# EAGLE schematic piezo-driver_v0.9a-R001 (EAGLE 6.5.0)

## Sheet 1 of 3
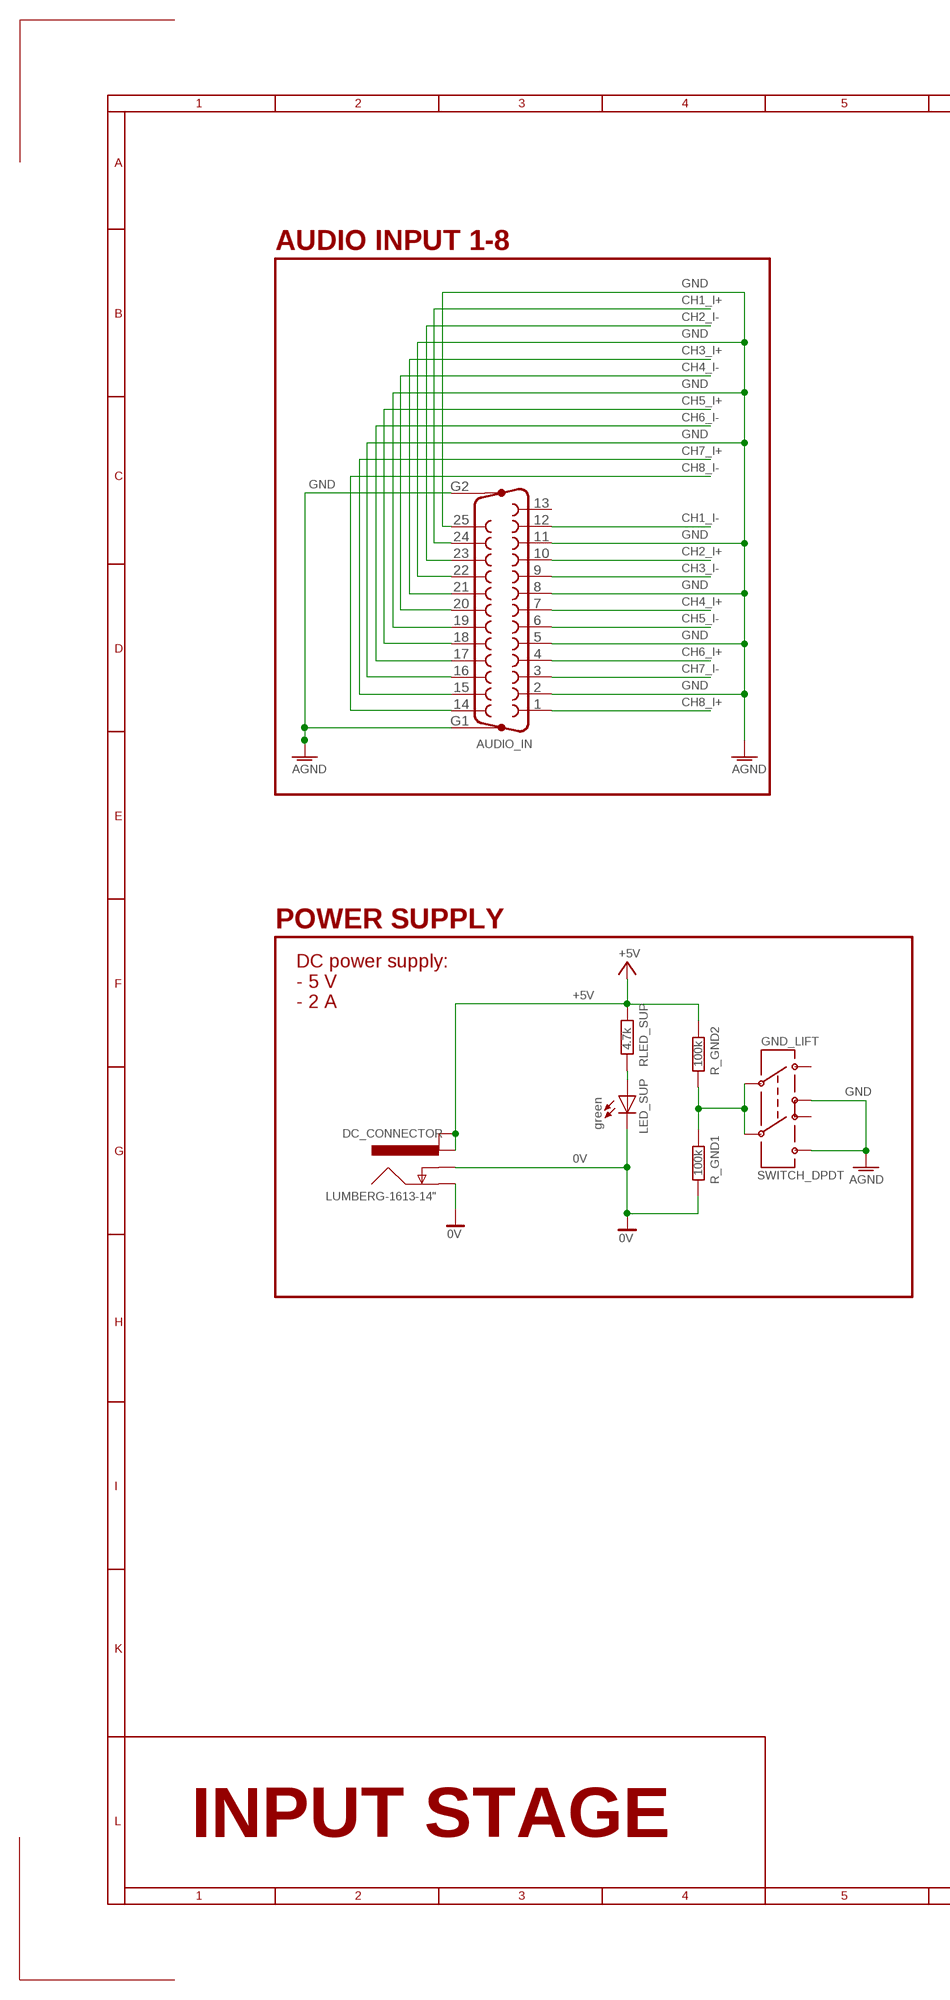
[diagram p0: schematic, sheet 1, part 1 of 2]
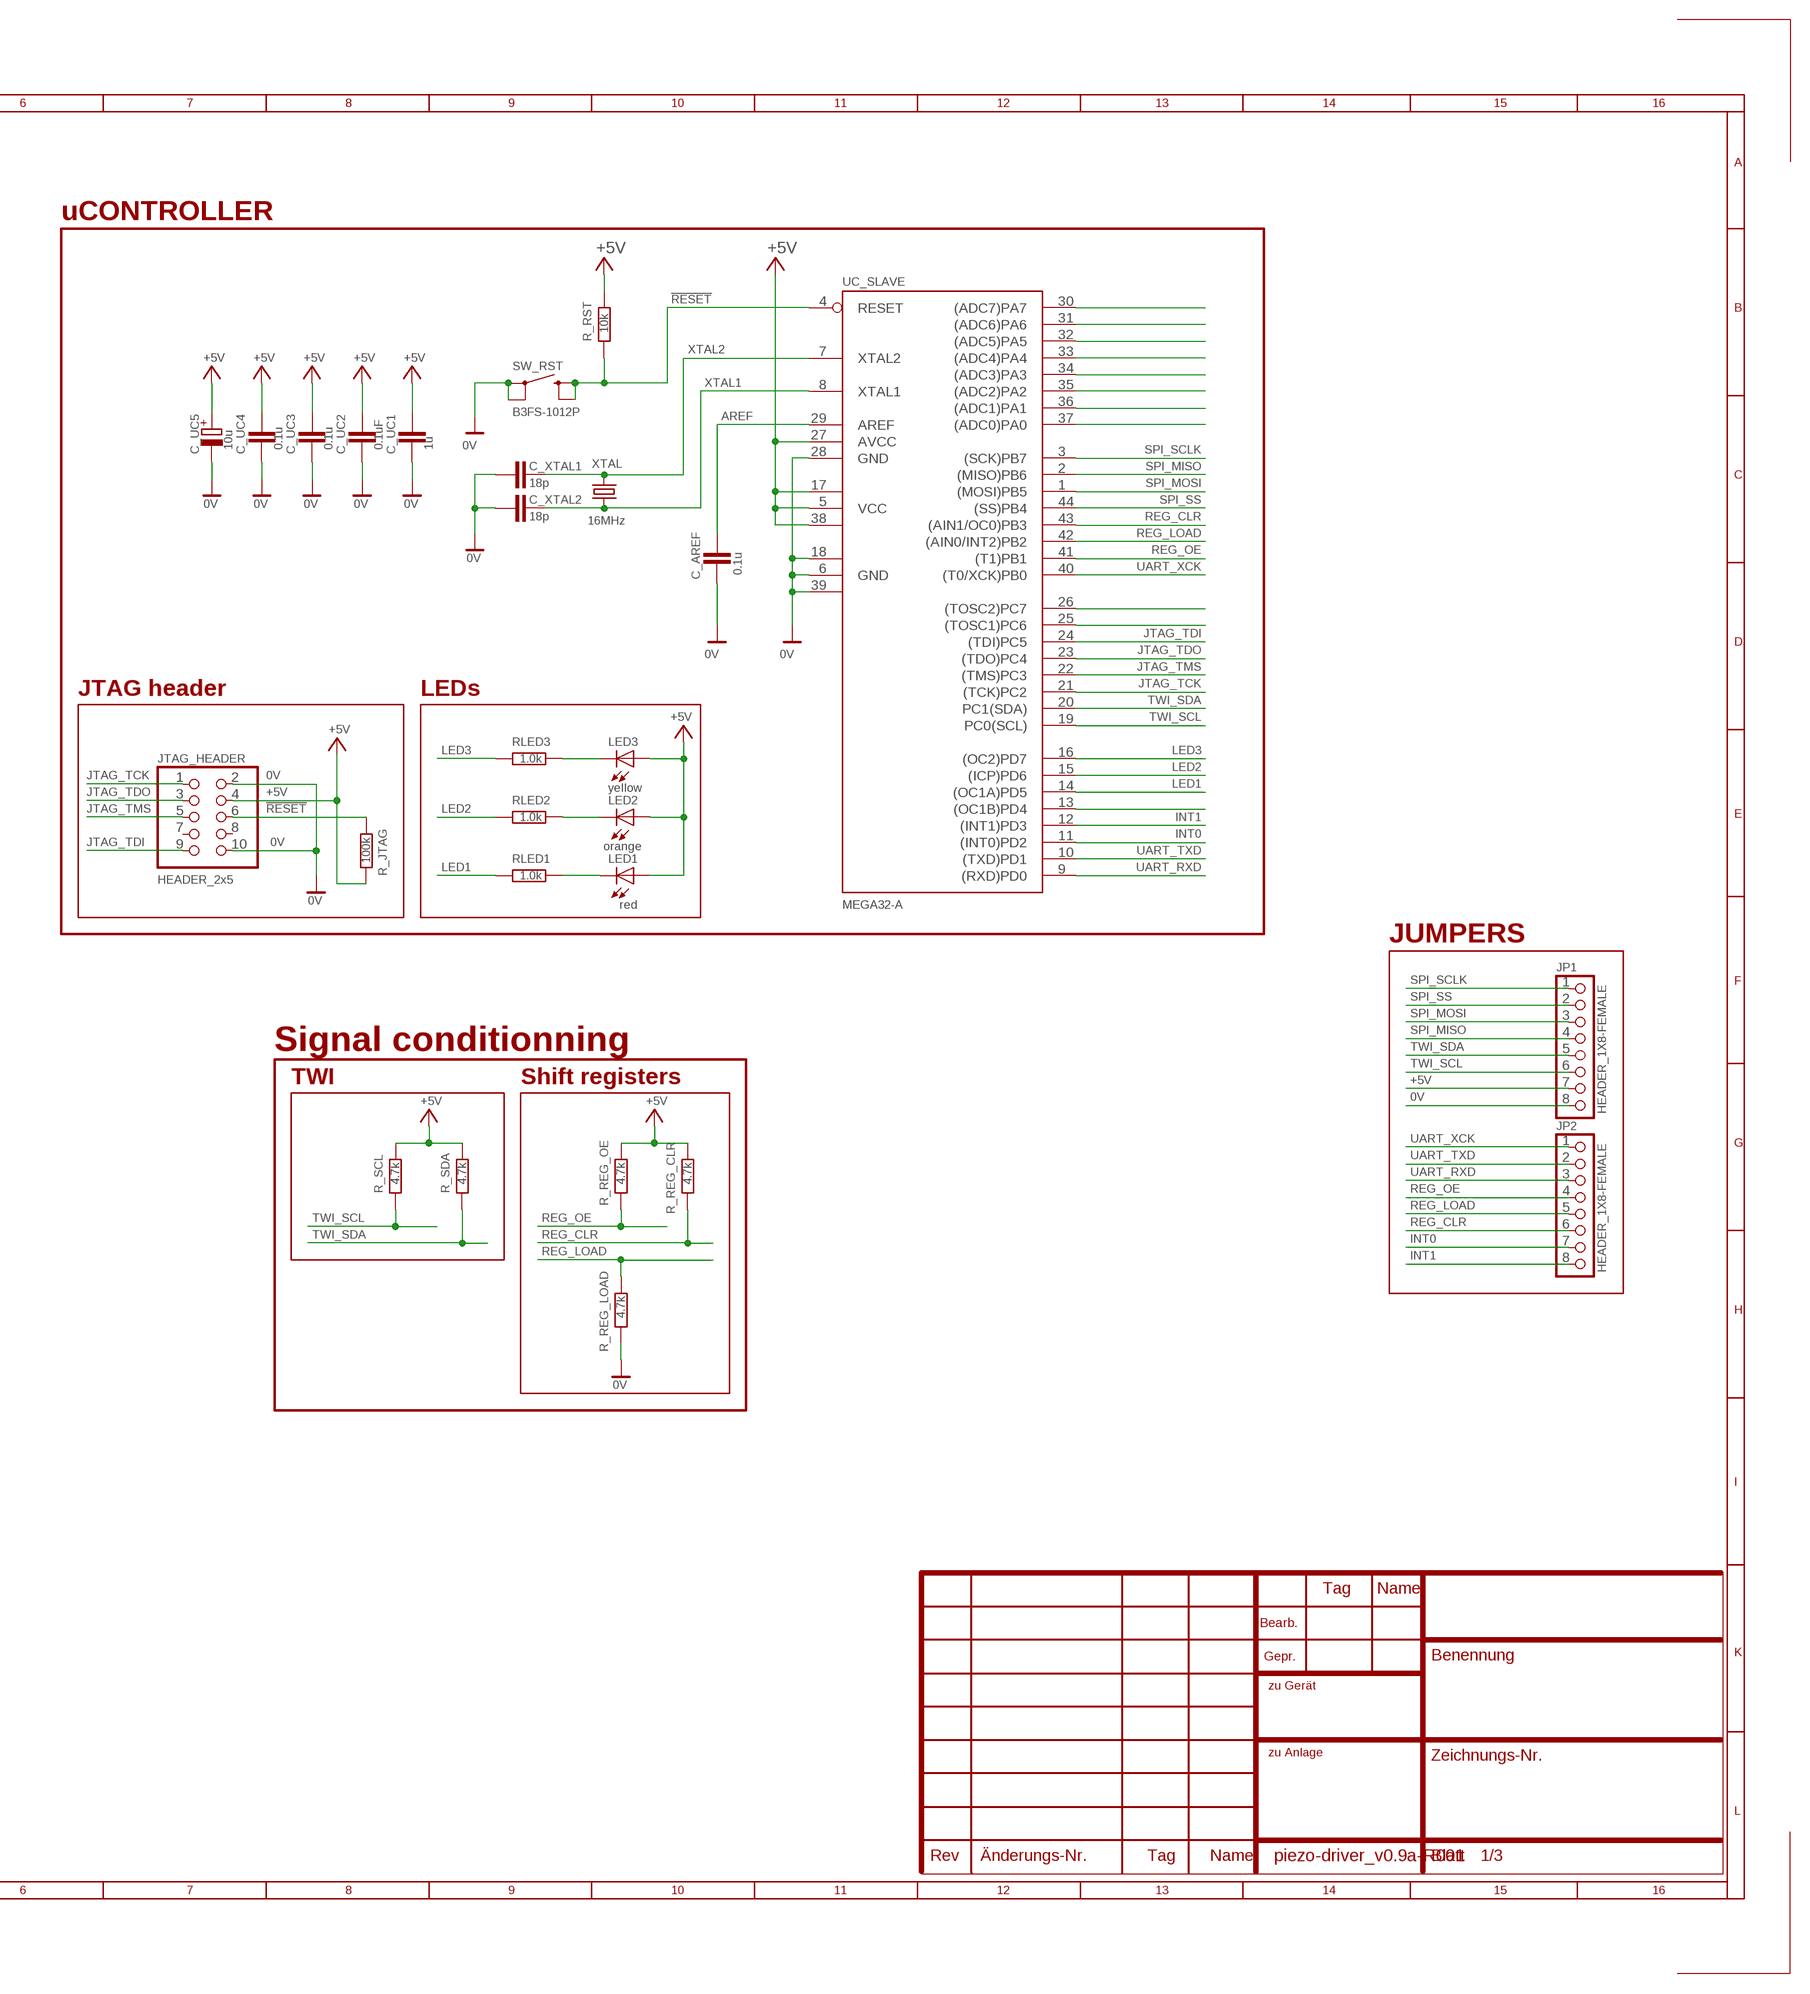
[diagram p1: schematic, sheet 1, part 2 of 2]

### Parts
AUDIO_IN  F25HP  [F25HP]
C_AREF  0.1u  C-EUC0402  [C0402]
C_UC1  1u  C-EUC0402  [C0402]
C_UC2  0.1uF  C-EUC0402  [C0402]
C_UC3  0.1u  C-EUC0402  [C0402]
C_UC4  0.1u  C-EUC0402  [C0402]
C_UC5  10u  CPOL-EUB/3528-21R  [B/3528-21R]
C_XTAL1  18p  C-EUC0402  [C0402]
C_XTAL2  18p  C-EUC0402  [C0402]
DC_CONNECTOR  LUMBERG-1613-14"  [LUMBERG-1613_14]
GND_LIFT  SWITCH_DPDT  [SWITCH_JS202011]
JP1  HEADER_1X8-FEMALE  [1X08_2.54]
JP2  HEADER_1X8-FEMALE  [1X08_2.54]
JTAG_HEADER  HEADER_2x5  PINHD-2X51.27  [2X05_1.27MM]
LED1  red  LED0603  [LED-0603]
LED2  orange  LED0603  [LED-0603]
LED3  yellow  LED0603  [LED-0603]
LED_SUP  green  LED0603  [LED-0603]
R_GND1  100k  R-EU_R0805  [R0805]
R_GND2  100k  R-EU_R0805  [R0805]
R_JTAG  100k  R-EU_R0402  [R0402]
R_REG_CLR  4.7k  R-EU_R0402  [R0402]
R_REG_LOAD  4.7k  R-EU_R0402  [R0402]
R_REG_OE  4.7k  R-EU_R0402  [R0402]
R_RST  10k  R-EU_R0402  [R0402]
R_SCL  4.7k  R-EU_R0402  [R0402]
R_SDA  4.7k  R-EU_R0402  [R0402]
RLED1  1.0k  R-EU_R0805  [R0805]
RLED2  1.0k  R-EU_R0805  [R0805]
RLED3  1.0k  R-EU_R0805  [R0805]
RLED_SUP  4.7k  R-EU_R0805  [R0805]
SW_RST  B3FS-1012P  [B3FS]
UC_SLAVE  MEGA32-A  [TQFP44]
XTAL  16MHz  CRYSTALCTS406  [CTS406]

### Nets
0V: DC_CONNECTOR.2(GND_INS) JP1.8 JTAG_HEADER.2 JTAG_HEADER.10 LED_SUP.C R_GND1.1 R_REG_LOAD.1 UC_SLAVE.6(GND) UC_SLAVE.18(GND1) UC_SLAVE.28(GND) UC_SLAVE.39(GND2) ; also sheet 2,3
!RESET: JTAG_HEADER.6 R_JTAG.1 R_RST.1 SW_RST.3(SW_1) SW_RST.4(SW_2) UC_SLAVE.4(RESET)
+5V: C_UC1.2 C_UC2.2 C_UC3.2 C_UC4.2 C_UC5.+ DC_CONNECTOR.3(PWR_1) DC_CONNECTOR.4(PWR_2) JP1.7 JTAG_HEADER.4 LED1.A LED2.A LED3.A R_GND2.2 R_JTAG.2 R_REG_CLR.2 R_REG_OE.2 R_RST.2 R_SCL.2 R_SDA.2 RLED_SUP.2 UC_SLAVE.5(VCC) UC_SLAVE.17(VCC1) UC_SLAVE.27(AVCC) UC_SLAVE.38(VCC2) ; also sheet 2,3
AREF: C_AREF.2 UC_SLAVE.29(AREF)
CH1_I+: AUDIO_IN.24 ; also sheet 2
CH1_I-: AUDIO_IN.12 ; also sheet 2
CH2_I+: AUDIO_IN.10 ; also sheet 2
CH2_I-: AUDIO_IN.23 ; also sheet 2
CH3_I+: AUDIO_IN.21 ; also sheet 2
CH3_I-: AUDIO_IN.9 ; also sheet 2
CH4_I+: AUDIO_IN.7 ; also sheet 2
CH4_I-: AUDIO_IN.20 ; also sheet 2
CH5_I+: AUDIO_IN.18 ; also sheet 2
CH5_I-: AUDIO_IN.6 ; also sheet 2
CH6_I+: AUDIO_IN.4 ; also sheet 2
CH6_I-: AUDIO_IN.17 ; also sheet 2
CH7_I+: AUDIO_IN.15 ; also sheet 2
CH7_I-: AUDIO_IN.3 ; also sheet 2
CH8_I+: AUDIO_IN.1 ; also sheet 2
CH8_I-: AUDIO_IN.14 ; also sheet 2
GND: AUDIO_IN.2 AUDIO_IN.5 AUDIO_IN.8 AUDIO_IN.11 AUDIO_IN.16 AUDIO_IN.19 AUDIO_IN.22 AUDIO_IN.25 AUDIO_IN.G1 AUDIO_IN.G2 C_AREF.1 C_UC1.1 C_UC2.1 C_UC3.1 C_UC4.1 C_UC5.- C_XTAL1.1 C_XTAL2.1 DC_CONNECTOR.1(GND) GND_LIFT.1(T1A) GND_LIFT.4(T2A) SW_RST.1(CON_1) SW_RST.2(CON_2) ; supply symbol labelled 0V, AGND
INT0: JP2.7 UC_SLAVE.11((INT0)PD2)
INT1: JP2.8 UC_SLAVE.12((INT1)PD3)
JTAG_TCK: JTAG_HEADER.1 UC_SLAVE.21((TCK)PC2)
JTAG_TDI: JTAG_HEADER.9 UC_SLAVE.24((TDI)PC5)
JTAG_TDO: JTAG_HEADER.3 UC_SLAVE.23((TDO)PC4)
JTAG_TMS: JTAG_HEADER.5 UC_SLAVE.22((TMS)PC3)
LED1: RLED1.1 UC_SLAVE.14((OC1A)PD5)
LED2: RLED2.1 UC_SLAVE.15((ICP)PD6)
LED3: RLED3.1 UC_SLAVE.16((OC2)PD7)
N$1: UC_SLAVE.30((ADC7)PA7)
N$15: LED_SUP.A RLED_SUP.1
N$60: UC_SLAVE.31((ADC6)PA6)
N$61: UC_SLAVE.32((ADC5)PA5)
N$62: UC_SLAVE.33((ADC4)PA4)
N$63: UC_SLAVE.34((ADC3)PA3)
N$64: UC_SLAVE.35((ADC2)PA2)
N$65: UC_SLAVE.36((ADC1)PA1)
N$66: UC_SLAVE.37((ADC0)PA0)
N$68: LED3.C RLED3.2
N$69: LED2.C RLED2.2
N$70: LED1.C RLED1.2
N$75: UC_SLAVE.26((TOSC2)PC7)
N$76: UC_SLAVE.25((TOSC1)PC6)
N$84: UC_SLAVE.13((OC1B)PD4)
N$1222: GND_LIFT.2(P1) GND_LIFT.5(P2) R_GND1.2 R_GND2.1
REG_CLR: JP2.6 R_REG_CLR.1 UC_SLAVE.43((AIN1/OC0)PB3) ; also sheet 3
REG_LOAD: JP2.5 R_REG_LOAD.2 UC_SLAVE.42((AIN0/INT2)PB2) ; also sheet 3
REG_OE: JP2.4 R_REG_OE.1 UC_SLAVE.41((T1)PB1) ; also sheet 3
SPI_MISO: JP1.4 UC_SLAVE.2((MISO)PB6)
SPI_MOSI: JP1.3 UC_SLAVE.1((MOSI)PB5) ; also sheet 3
SPI_SCLK: JP1.1 UC_SLAVE.3((SCK)PB7) ; also sheet 3
SPI_SS: JP1.2 UC_SLAVE.44((SS)PB4)
TWI_SCL: JP1.6 R_SCL.1 UC_SLAVE.19(PC0(SCL)) ; also sheet 2
TWI_SDA: JP1.5 R_SDA.1 UC_SLAVE.20(PC1(SDA)) ; also sheet 2
UART_RXD: JP2.3 UC_SLAVE.9((RXD)PD0)
UART_TXD: JP2.2 UC_SLAVE.10((TXD)PD1) ; also sheet 3
UART_XCK: JP2.1 UC_SLAVE.40((T0/XCK)PB0)
XTAL1: C_XTAL2.2 UC_SLAVE.8(XTAL1) XTAL.1
XTAL2: C_XTAL1.2 UC_SLAVE.7(XTAL2) XTAL.3
Unconnected: AUDIO_IN.13 GND_LIFT.3(T1B) GND_LIFT.6(T2B) JTAG_HEADER.7 JTAG_HEADER.8

### Notes on the sheet
- uCONTROLLER
- AUDIO INPUT 1-8
- JTAG header | LEDs
- POWER SUPPLY
- JUMPERS
- DC power supply:
  - 5 V
  - 2 A
- Signal conditionning
- TWI | Shift registers
- INPUT STAGE

## Sheet 2 of 3
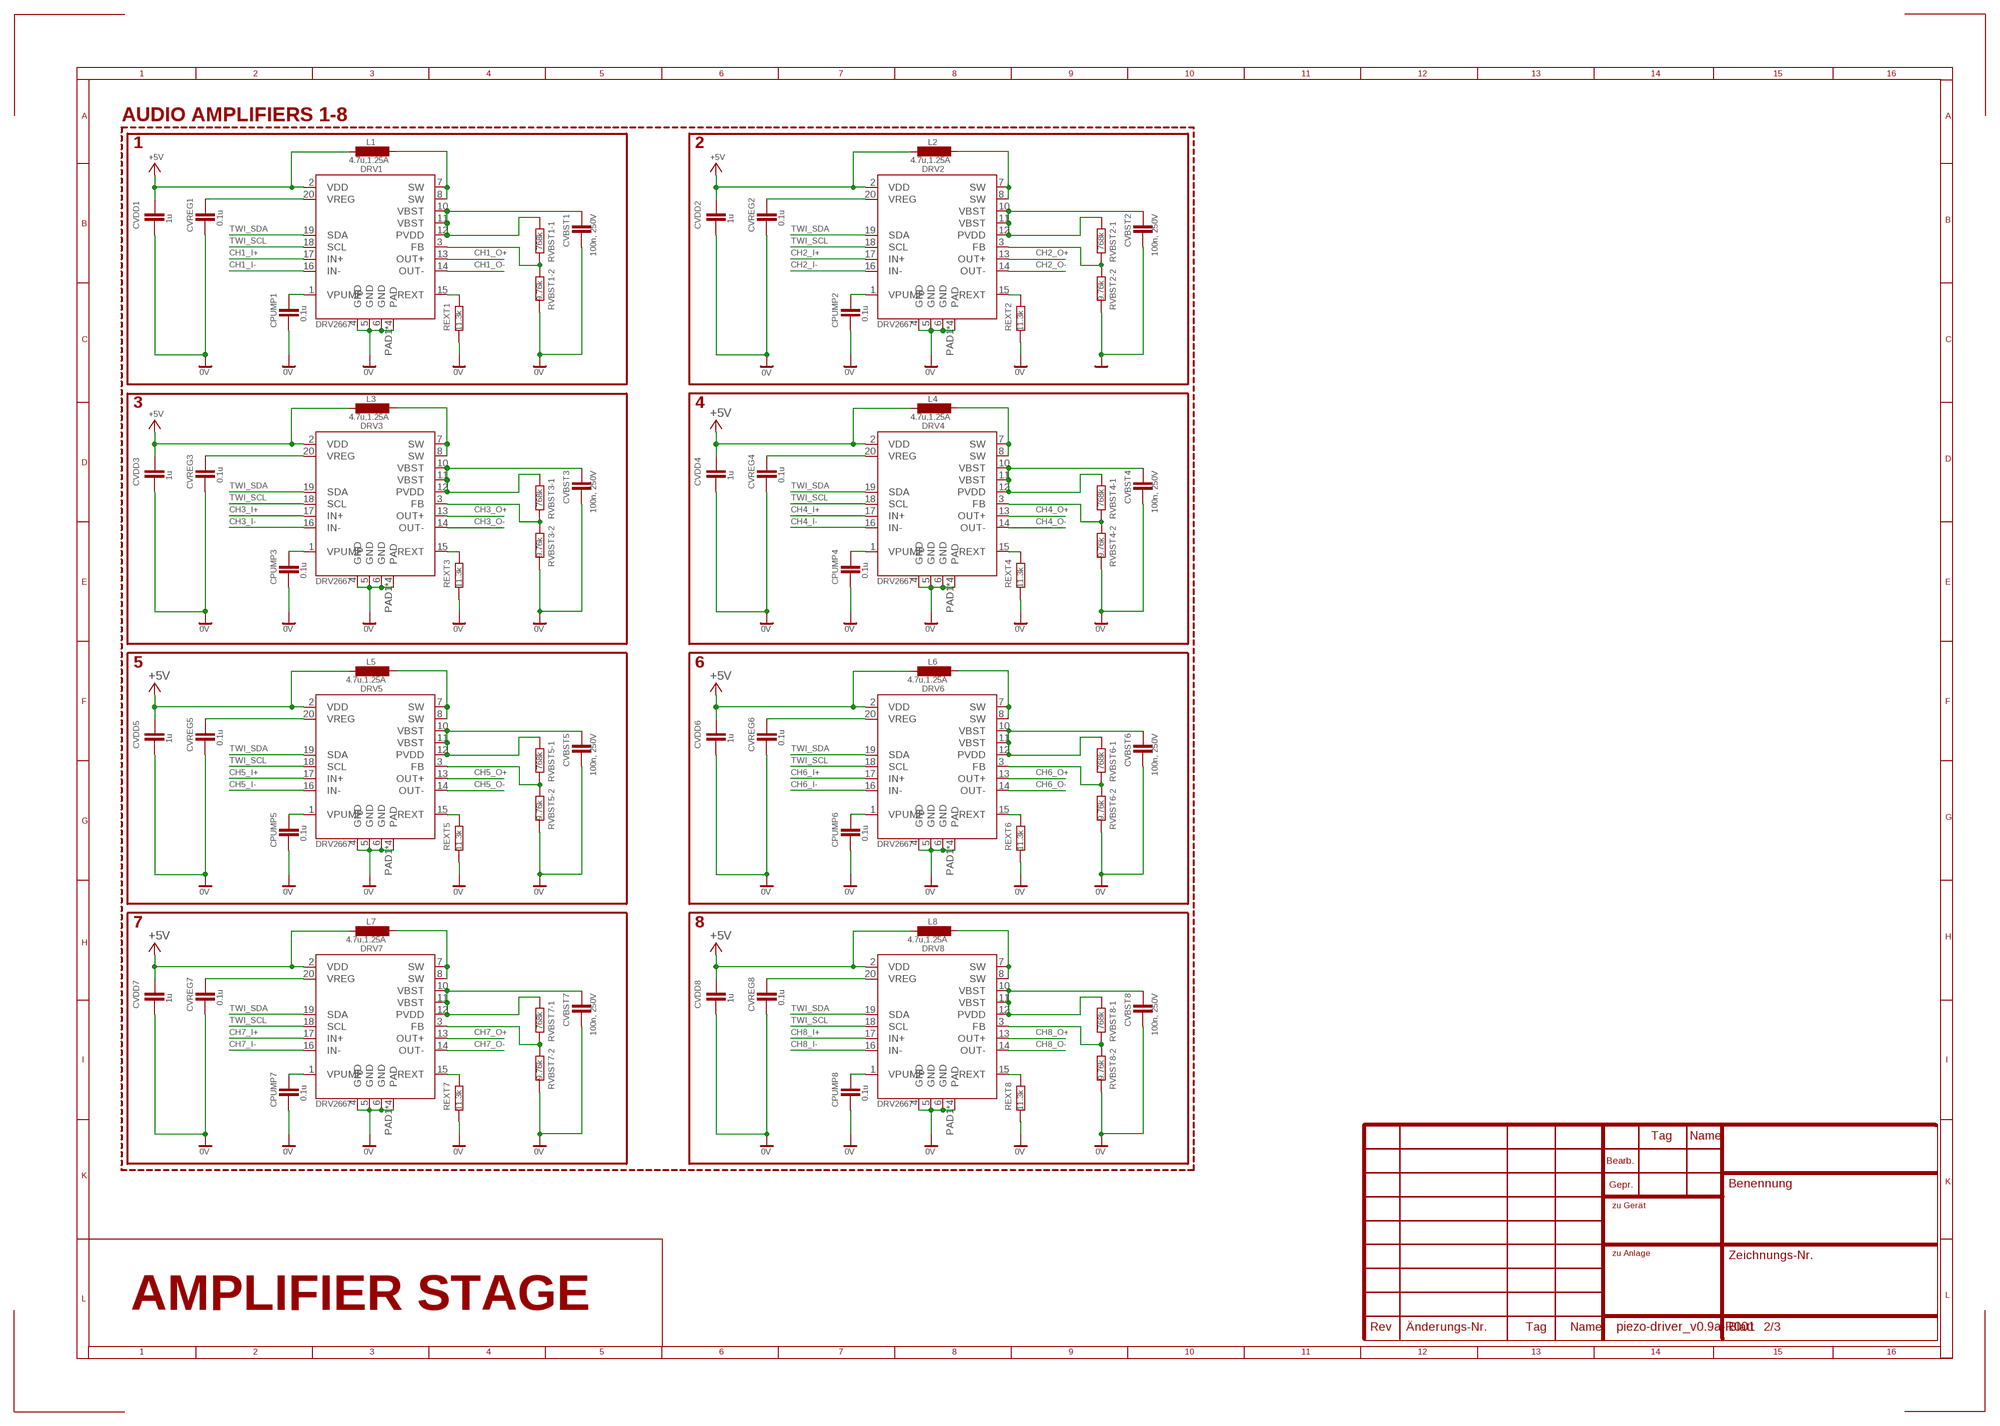
[diagram p2: schematic, sheet 2]

### Parts
CPUMP1  0.1u  C-EUC0805  [C0805]
CPUMP2  0.1u  C-EUC0805  [C0805]
CPUMP3  0.1u  C-EUC0805  [C0805]
CPUMP4  0.1u  C-EUC0805  [C0805]
CPUMP5  0.1u  C-EUC0805  [C0805]
CPUMP6  0.1u  C-EUC0805  [C0805]
CPUMP7  0.1u  C-EUC0805  [C0805]
CPUMP8  0.1u  C-EUC0805  [C0805]
CVBST1  100n, 250V  C-EUC0805  [C0805]
CVBST2  100n, 250V  C-EUC0805  [C0805]
CVBST3  100n, 250V  C-EUC0805  [C0805]
CVBST4  100n, 250V  C-EUC0805  [C0805]
CVBST5  100n, 250V  C-EUC0805  [C0805]
CVBST6  100n, 250V  C-EUC0805  [C0805]
CVBST7  100n, 250V  C-EUC0805  [C0805]
CVBST8  100n, 250V  C-EUC0805  [C0805]
CVDD1  1u  C-EUC0805  [C0805]
CVDD2  1u  C-EUC0805  [C0805]
CVDD3  1u  C-EUC0805  [C0805]
CVDD4  1u  C-EUC0805  [C0805]
CVDD5  1u  C-EUC0805  [C0805]
CVDD6  1u  C-EUC0805  [C0805]
CVDD7  1u  C-EUC0805  [C0805]
CVDD8  1u  C-EUC0805  [C0805]
CVREG1  0.1u  C-EUC0805  [C0805]
CVREG2  0.1u  C-EUC0805  [C0805]
CVREG3  0.1u  C-EUC0805  [C0805]
CVREG4  0.1u  C-EUC0805  [C0805]
CVREG5  0.1u  C-EUC0805  [C0805]
CVREG6  0.1u  C-EUC0805  [C0805]
CVREG7  0.1u  C-EUC0805  [C0805]
CVREG8  0.1u  C-EUC0805  [C0805]
DRV1  DRV2667QFN  [QFN400X400]
DRV2  DRV2667QFN  [QFN400X400]
DRV3  DRV2667QFN  [QFN400X400]
DRV4  DRV2667QFN  [QFN400X400]
DRV5  DRV2667QFN  [QFN400X400]
DRV6  DRV2667QFN  [QFN400X400]
DRV7  DRV2667QFN  [QFN400X400]
DRV8  DRV2667QFN  [QFN400X400]
L1  4.7u,1.25A  L-EUL3225M  [L3225M]
L2  4.7u,1.25A  L-EUL3225M  [L3225M]
L3  4.7u,1.25A  L-EUL3225M  [L3225M]
L4  4.7u,1.25A  L-EUL3225M  [L3225M]
L5  4.7u,1.25A  L-EUL3225M  [L3225M]
L6  4.7u,1.25A  L-EUL3225M  [L3225M]
L7  4.7u,1.25A  L-EUL3225M  [L3225M]
L8  4.7u,1.25A  L-EUL3225M  [L3225M]
REXT1  11.3k  R-EU_R0805  [R0805]
REXT2  11.3k  R-EU_R0805  [R0805]
REXT3  11.3k  R-EU_R0805  [R0805]
REXT4  11.3k  R-EU_R0805  [R0805]
REXT5  11.3k  R-EU_R0805  [R0805]
REXT6  11.3k  R-EU_R0805  [R0805]
REXT7  11.3k  R-EU_R0805  [R0805]
REXT8  11.3k  R-EU_R0805  [R0805]
RVBST1-1  768k  R-EU_R0805  [R0805]
RVBST1-2  9.76k  R-EU_R0805  [R0805]
RVBST2-1  768k  R-EU_R0805  [R0805]
RVBST2-2  9.76k  R-EU_R0805  [R0805]
RVBST3-1  768k  R-EU_R0805  [R0805]
RVBST3-2  9.76k  R-EU_R0805  [R0805]
RVBST4-1  768k  R-EU_R0805  [R0805]
RVBST4-2  9.76k  R-EU_R0805  [R0805]
RVBST5-1  768k  R-EU_R0805  [R0805]
RVBST5-2  9.76k  R-EU_R0805  [R0805]
RVBST6-1  768k  R-EU_R0805  [R0805]
RVBST6-2  9.76k  R-EU_R0805  [R0805]
RVBST7-1  768k  R-EU_R0805  [R0805]
RVBST7-2  9.76k  R-EU_R0805  [R0805]
RVBST8-1  768k  R-EU_R0805  [R0805]
RVBST8-2  9.76k  R-EU_R0805  [R0805]

### Nets
0V: CPUMP1.2 CPUMP2.2 CPUMP3.2 CPUMP4.2 CPUMP5.2 CPUMP6.2 CPUMP7.2 CPUMP8.2 CVBST1.2 CVBST2.2 CVBST3.2 CVBST4.2 CVBST5.2 CVBST6.2 CVBST7.2 CVBST8.2 CVDD1.2 CVDD2.2 CVDD3.2 CVDD4.2 CVDD5.2 CVDD6.2 CVDD7.2 CVDD8.2 CVREG1.2 CVREG2.2 CVREG3.2 CVREG4.2 CVREG5.2 CVREG6.2 CVREG7.2 CVREG8.2 DRV1.4(GND) DRV1.5(GND) DRV1.6(GND) DRV1.PAD1(PAD) DRV1.PAD2(PAD) DRV1.PAD3(PAD) DRV1.PAD4(PAD) DRV2.4(GND) DRV2.5(GND) DRV2.6(GND) DRV2.PAD1(PAD) DRV2.PAD2(PAD) DRV2.PAD3(PAD) DRV2.PAD4(PAD) DRV3.4(GND) DRV3.5(GND) DRV3.6(GND) DRV3.PAD1(PAD) DRV3.PAD2(PAD) DRV3.PAD3(PAD) DRV3.PAD4(PAD) DRV4.4(GND) DRV4.5(GND) DRV4.6(GND) DRV4.PAD1(PAD) DRV4.PAD2(PAD) DRV4.PAD3(PAD) DRV4.PAD4(PAD) DRV5.4(GND) DRV5.5(GND) DRV5.6(GND) DRV5.PAD1(PAD) DRV5.PAD2(PAD) DRV5.PAD3(PAD) DRV5.PAD4(PAD) DRV6.4(GND) DRV6.5(GND) DRV6.6(GND) DRV6.PAD1(PAD) DRV6.PAD2(PAD) DRV6.PAD3(PAD) DRV6.PAD4(PAD) DRV7.4(GND) DRV7.5(GND) DRV7.6(GND) DRV7.PAD1(PAD) DRV7.PAD2(PAD) DRV7.PAD3(PAD) DRV7.PAD4(PAD) DRV8.4(GND) DRV8.5(GND) DRV8.6(GND) DRV8.PAD1(PAD) DRV8.PAD2(PAD) DRV8.PAD3(PAD) DRV8.PAD4(PAD) REXT1.1 REXT2.1 REXT3.1 REXT4.1 REXT5.1 REXT6.1 REXT7.1 REXT8.1 RVBST1-2.1 RVBST2-2.1 RVBST3-2.1 RVBST4-2.1 RVBST5-2.1 RVBST6-2.1 RVBST7-2.1 RVBST8-2.1 ; also sheet 1,3
+5V: CVDD1.1 CVDD2.1 CVDD3.1 CVDD4.1 CVDD5.1 CVDD6.1 CVDD7.1 CVDD8.1 DRV1.2(VDD) DRV2.2(VDD) DRV3.2(VDD) DRV4.2(VDD) DRV5.2(VDD) DRV6.2(VDD) DRV7.2(VDD) DRV8.2(VDD) L1.2 L2.2 L3.2 L4.2 L5.2 L6.2 L7.2 L8.2 ; also sheet 1,3
CH1_I+: DRV1.17(IN+) ; also sheet 1
CH1_I-: DRV1.16(IN-) ; also sheet 1
CH1_O+: DRV1.13(OUT+) ; also sheet 3
CH1_O-: DRV1.14(OUT-) ; also sheet 3
CH2_I+: DRV2.17(IN+) ; also sheet 1
CH2_I-: DRV2.16(IN-) ; also sheet 1
CH2_O+: DRV2.13(OUT+) ; also sheet 3
CH2_O-: DRV2.14(OUT-) ; also sheet 3
CH3_I+: DRV3.17(IN+) ; also sheet 1
CH3_I-: DRV3.16(IN-) ; also sheet 1
CH3_O+: DRV3.13(OUT+) ; also sheet 3
CH3_O-: DRV3.14(OUT-) ; also sheet 3
CH4_I+: DRV4.17(IN+) ; also sheet 1
CH4_I-: DRV4.16(IN-) ; also sheet 1
CH4_O+: DRV4.13(OUT+) ; also sheet 3
CH4_O-: DRV4.14(OUT-) ; also sheet 3
CH5_I+: DRV5.17(IN+) ; also sheet 1
CH5_I-: DRV5.16(IN-) ; also sheet 1
CH5_O+: DRV5.13(OUT+) ; also sheet 3
CH5_O-: DRV5.14(OUT-) ; also sheet 3
CH6_I+: DRV6.17(IN+) ; also sheet 1
CH6_I-: DRV6.16(IN-) ; also sheet 1
CH6_O+: DRV6.13(OUT+) ; also sheet 3
CH6_O-: DRV6.14(OUT-) ; also sheet 3
CH7_I+: DRV7.17(IN+) ; also sheet 1
CH7_I-: DRV7.16(IN-) ; also sheet 1
CH7_O+: DRV7.13(OUT+) ; also sheet 3
CH7_O-: DRV7.14(OUT-) ; also sheet 3
CH8_I+: DRV8.17(IN+) ; also sheet 1
CH8_I-: DRV8.16(IN-) ; also sheet 1
CH8_O+: DRV8.13(OUT+) ; also sheet 3
CH8_O-: DRV8.14(OUT-) ; also sheet 3
N$2: DRV1.7(SW) DRV1.8(SW) L1.1
N$3: CVBST1.1 DRV1.10(VBST) DRV1.11(VBST) DRV1.12(PVDD) RVBST1-1.2
N$4: DRV1.3(FB) RVBST1-1.1 RVBST1-2.2
N$5: DRV1.15(REXT) REXT1.2
N$6: CPUMP1.1 DRV1.1(VPUMP)
N$7: CVREG1.1 DRV1.20(VREG)
N$14: DRV3.7(SW) DRV3.8(SW) L3.1
N$16: CVBST3.1 DRV3.10(VBST) DRV3.11(VBST) DRV3.12(PVDD) RVBST3-1.2
N$17: DRV3.3(FB) RVBST3-1.1 RVBST3-2.2
N$18: DRV3.15(REXT) REXT3.2
N$19: CPUMP3.1 DRV3.1(VPUMP)
N$20: CVREG3.1 DRV3.20(VREG)
N$21: DRV2.7(SW) DRV2.8(SW) L2.1
N$22: CVBST2.1 DRV2.10(VBST) DRV2.11(VBST) DRV2.12(PVDD) RVBST2-1.2
N$23: DRV2.3(FB) RVBST2-1.1 RVBST2-2.2
N$24: DRV2.15(REXT) REXT2.2
N$25: CPUMP2.1 DRV2.1(VPUMP)
N$26: CVREG2.1 DRV2.20(VREG)
N$27: DRV4.7(SW) DRV4.8(SW) L4.1
N$28: CVBST4.1 DRV4.10(VBST) DRV4.11(VBST) DRV4.12(PVDD) RVBST4-1.2
N$29: DRV4.3(FB) RVBST4-1.1 RVBST4-2.2
N$30: DRV4.15(REXT) REXT4.2
N$31: CPUMP4.1 DRV4.1(VPUMP)
N$32: CVREG4.1 DRV4.20(VREG)
N$33: DRV5.7(SW) DRV5.8(SW) L5.1
N$34: CVBST5.1 DRV5.10(VBST) DRV5.11(VBST) DRV5.12(PVDD) RVBST5-1.2
N$35: DRV5.3(FB) RVBST5-1.1 RVBST5-2.2
N$36: DRV5.15(REXT) REXT5.2
N$37: CPUMP5.1 DRV5.1(VPUMP)
N$38: CVREG5.1 DRV5.20(VREG)
N$39: DRV7.7(SW) DRV7.8(SW) L7.1
N$40: CVBST7.1 DRV7.10(VBST) DRV7.11(VBST) DRV7.12(PVDD) RVBST7-1.2
N$41: DRV7.3(FB) RVBST7-1.1 RVBST7-2.2
N$42: DRV7.15(REXT) REXT7.2
N$43: CPUMP7.1 DRV7.1(VPUMP)
N$44: CVREG7.1 DRV7.20(VREG)
N$45: DRV6.7(SW) DRV6.8(SW) L6.1
N$46: CVBST6.1 DRV6.10(VBST) DRV6.11(VBST) DRV6.12(PVDD) RVBST6-1.2
N$47: DRV6.3(FB) RVBST6-1.1 RVBST6-2.2
N$48: DRV6.15(REXT) REXT6.2
N$49: CPUMP6.1 DRV6.1(VPUMP)
N$50: CVREG6.1 DRV6.20(VREG)
N$51: DRV8.7(SW) DRV8.8(SW) L8.1
N$52: CVBST8.1 DRV8.10(VBST) DRV8.11(VBST) DRV8.12(PVDD) RVBST8-1.2
N$53: DRV8.3(FB) RVBST8-1.1 RVBST8-2.2
N$54: DRV8.15(REXT) REXT8.2
N$55: CPUMP8.1 DRV8.1(VPUMP)
N$56: CVREG8.1 DRV8.20(VREG)
TWI_SCL: DRV1.18(SCL) DRV2.18(SCL) DRV3.18(SCL) DRV4.18(SCL) DRV5.18(SCL) DRV6.18(SCL) DRV7.18(SCL) DRV8.18(SCL) ; also sheet 1
TWI_SDA: DRV1.19(SDA) DRV2.19(SDA) DRV3.19(SDA) DRV4.19(SDA) DRV5.19(SDA) DRV6.19(SDA) DRV7.19(SDA) DRV8.19(SDA) ; also sheet 1

### Notes on the sheet
- AUDIO AMPLIFIERS 1-8
- 1 | 2
- 3 | 4
- 5 | 6
- 7 | 8
- AMPLIFIER STAGE

## Sheet 3 of 3
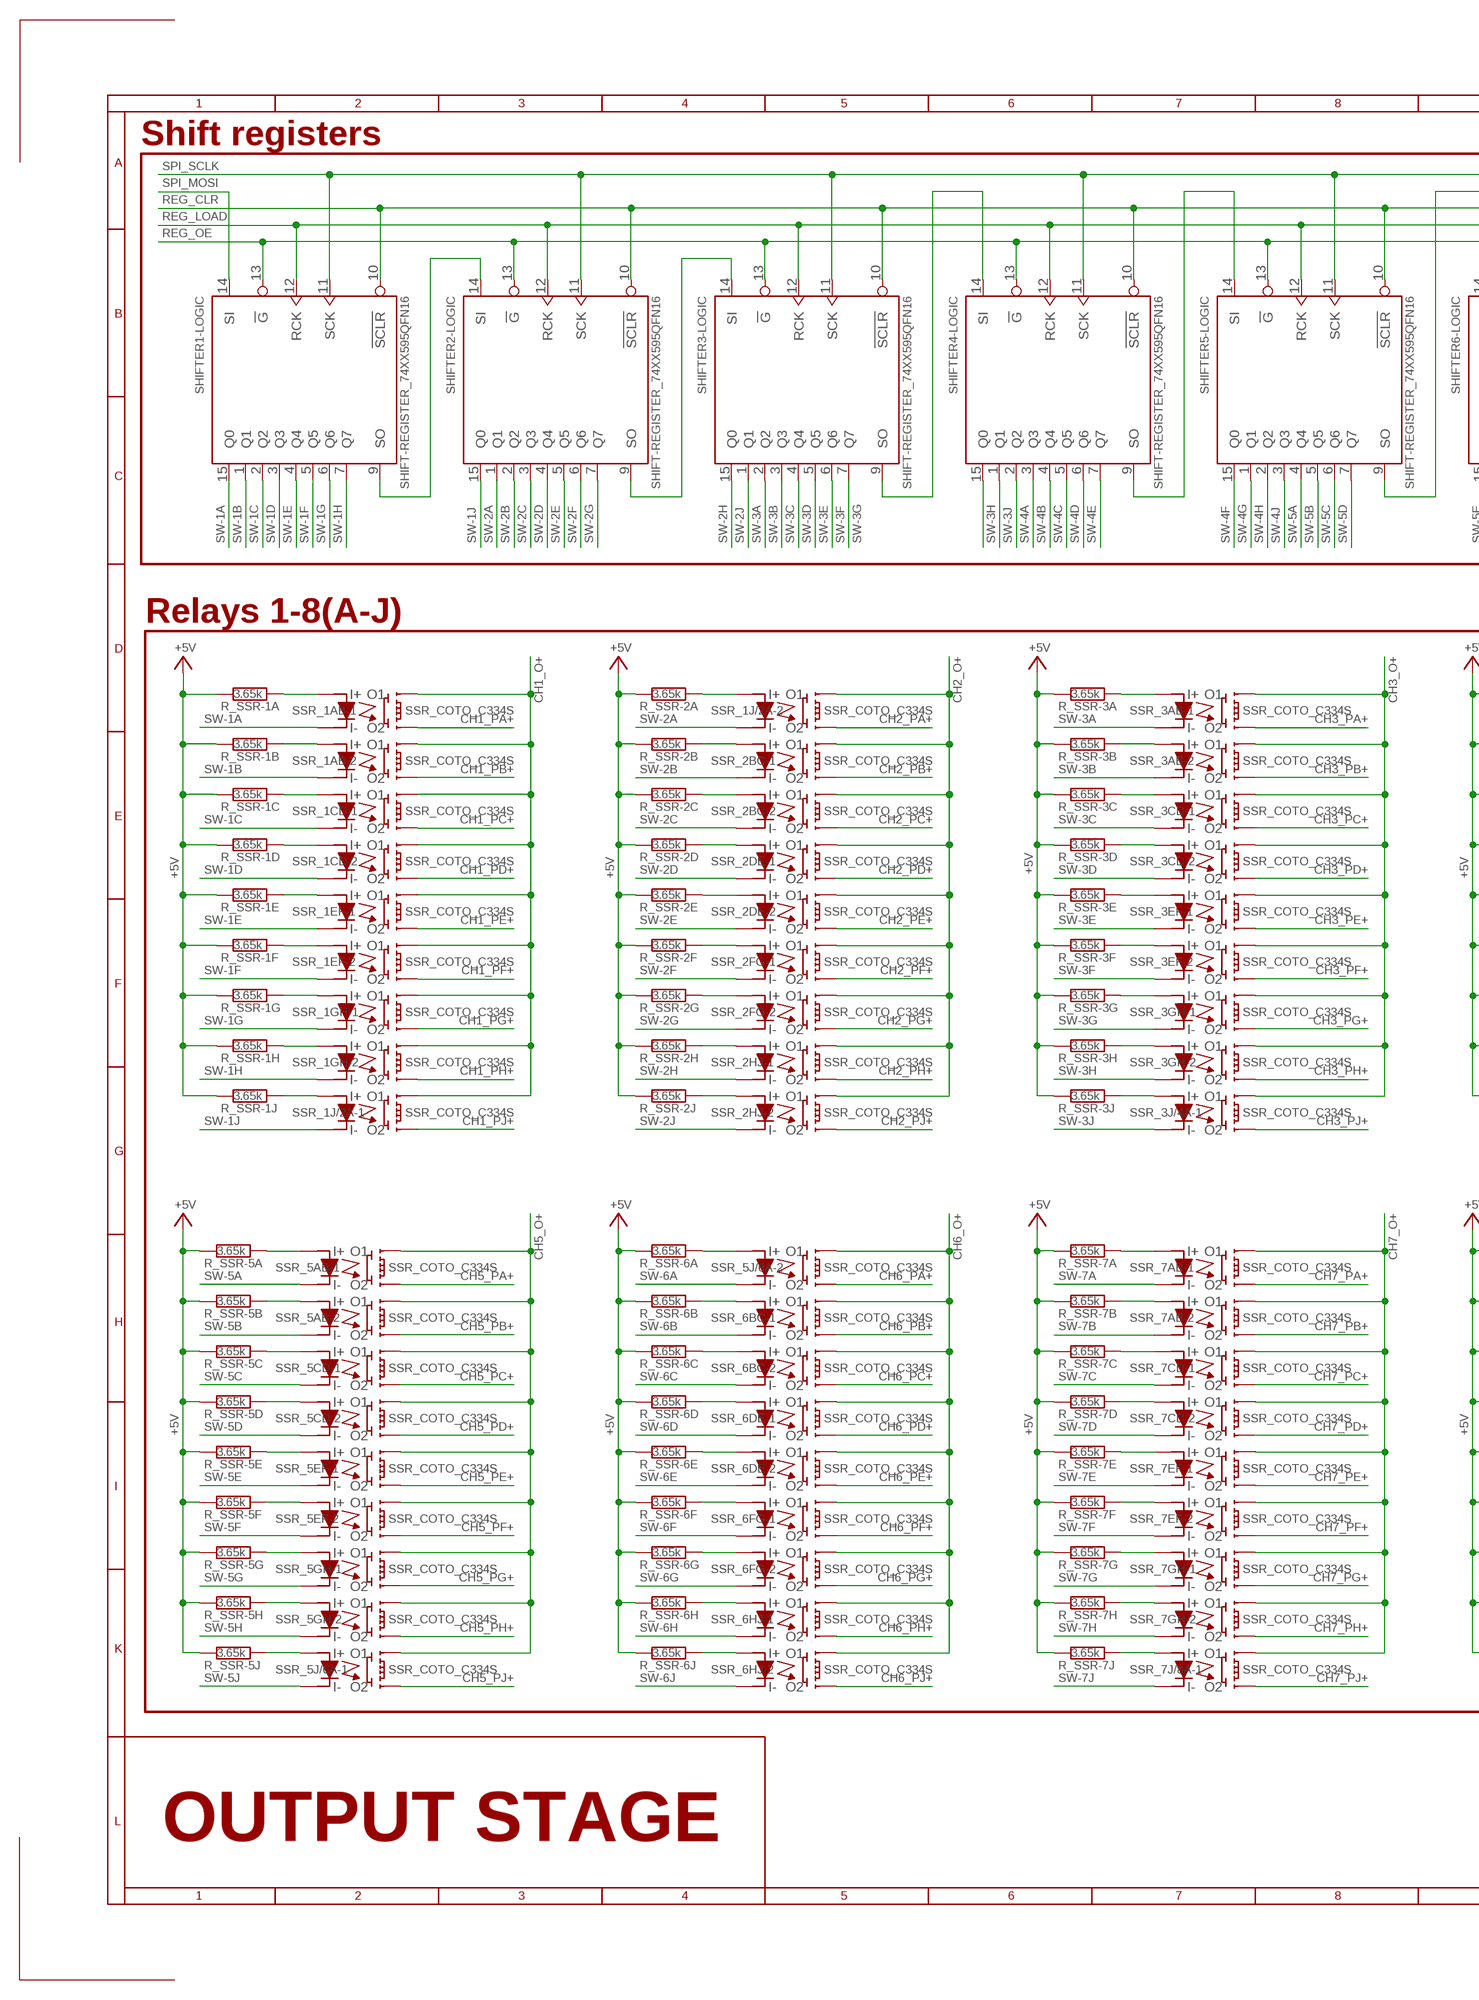
[diagram p3: schematic, sheet 3, part 1 of 2]
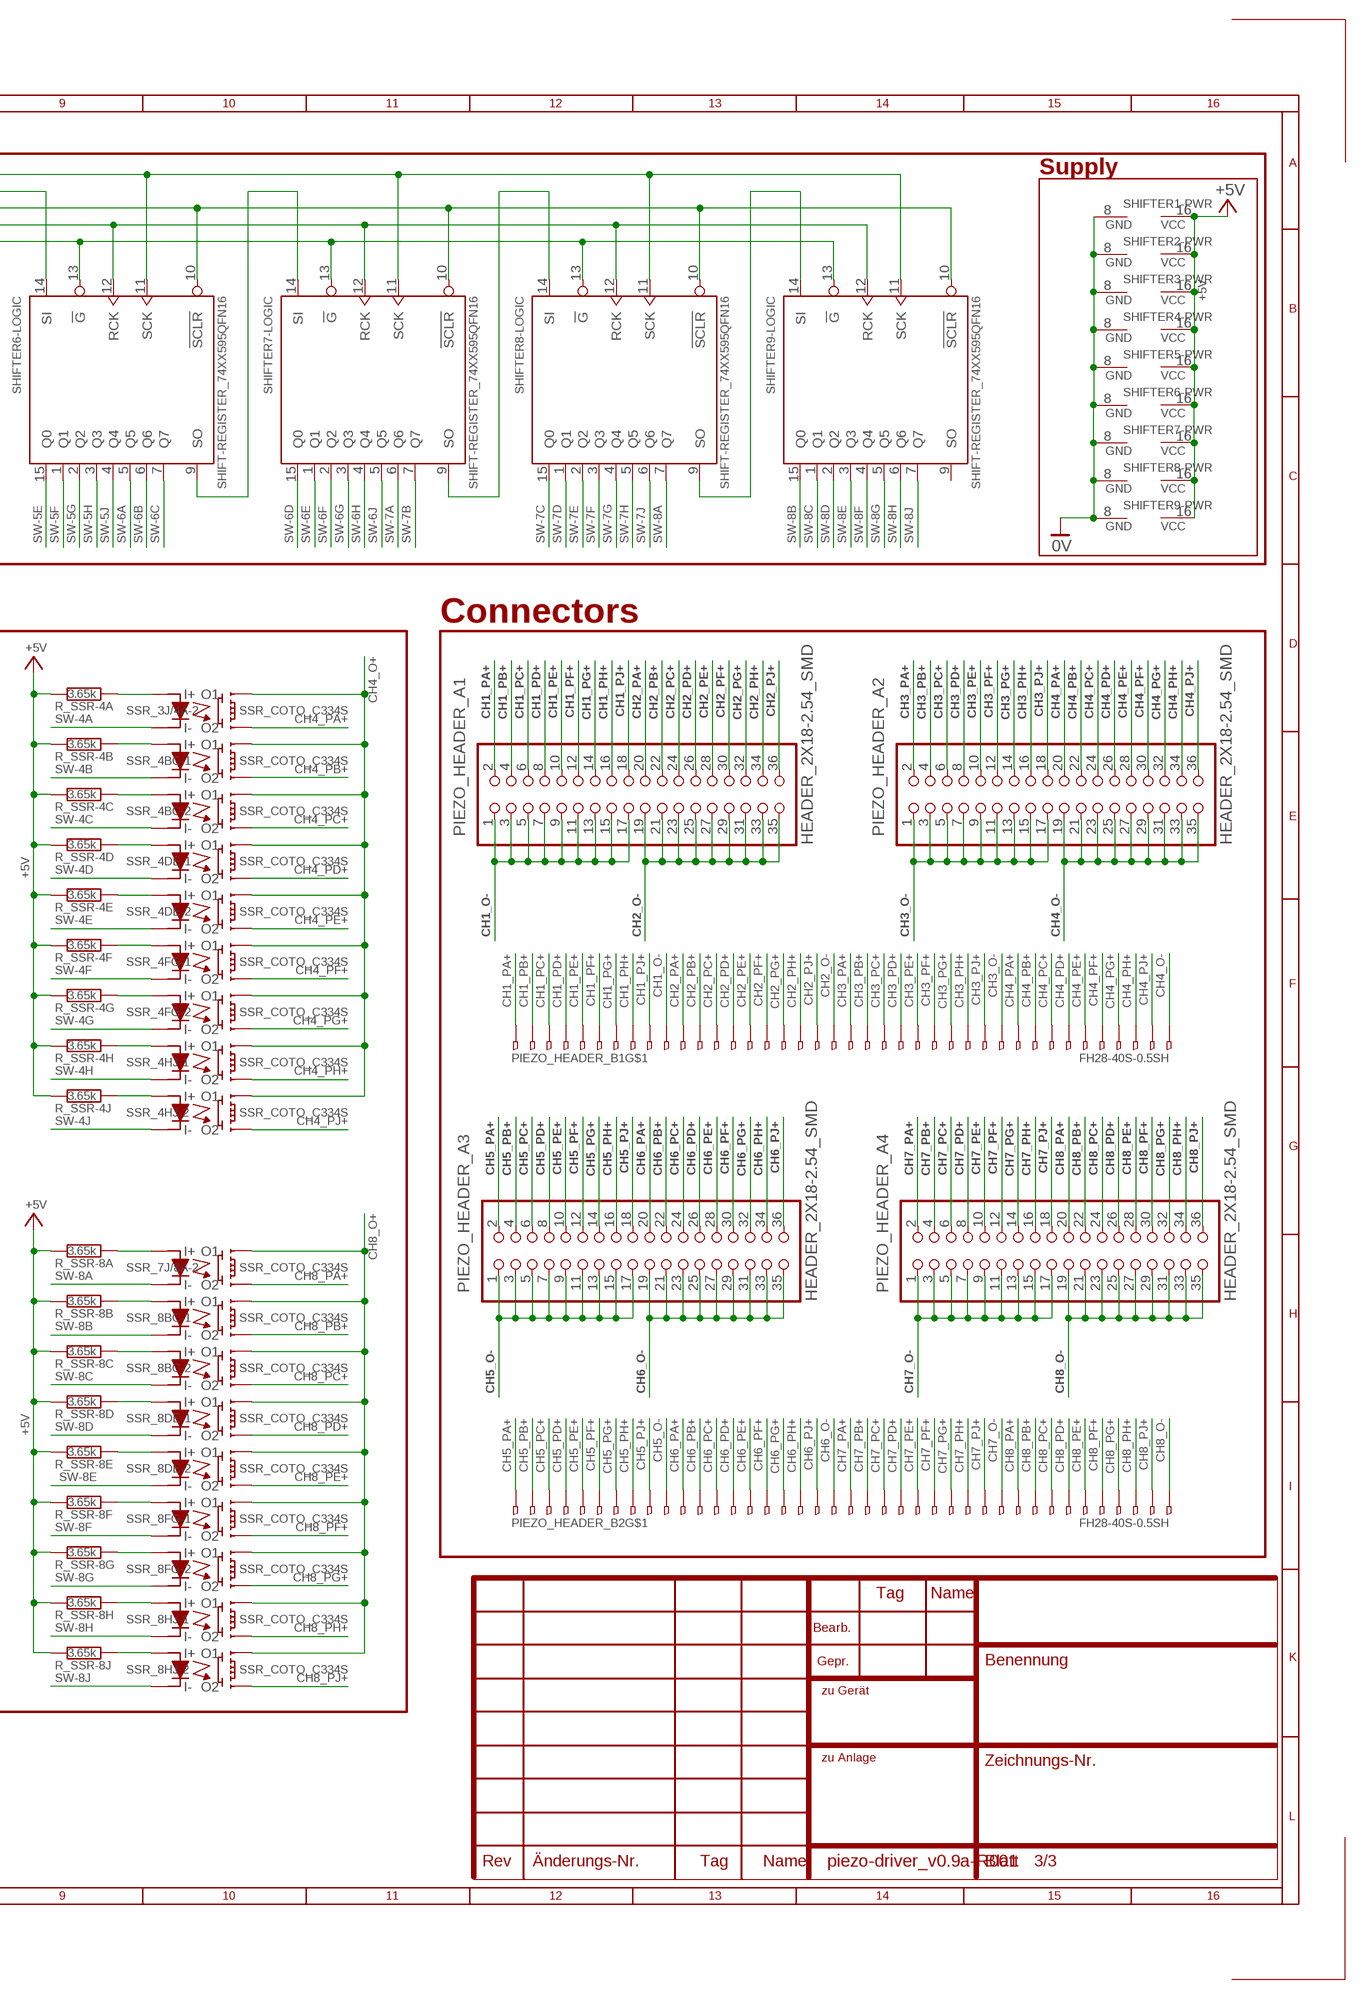
[diagram p4: schematic, sheet 3, part 2 of 2]

### Parts
PIEZO_HEADER_A1  HEADER_2X18-2.54_SMD  [2X18_2.54_SMD]
PIEZO_HEADER_A2  HEADER_2X18-2.54_SMD  [2X18_2.54_SMD]
PIEZO_HEADER_A3  HEADER_2X18-2.54_SMD  [2X18_2.54_SMD]
PIEZO_HEADER_A4  HEADER_2X18-2.54_SMD  [2X18_2.54_SMD]
PIEZO_HEADER_B1  FH28-40S-0.5SH  [FH28-40S-0.5SH]
PIEZO_HEADER_B2  FH28-40S-0.5SH  [FH28-40S-0.5SH]
R_SSR-1A  3.65k  R-EU_R0805  [R0805]
R_SSR-1B  3.65k  R-EU_R0805  [R0805]
R_SSR-1C  3.65k  R-EU_R0805  [R0805]
R_SSR-1D  3.65k  R-EU_R0805  [R0805]
R_SSR-1E  3.65k  R-EU_R0805  [R0805]
R_SSR-1F  3.65k  R-EU_R0805  [R0805]
R_SSR-1G  3.65k  R-EU_R0805  [R0805]
R_SSR-1H  3.65k  R-EU_R0805  [R0805]
R_SSR-1J  3.65k  R-EU_R0805  [R0805]
R_SSR-2A  3.65k  R-EU_R0805  [R0805]
R_SSR-2B  3.65k  R-EU_R0805  [R0805]
R_SSR-2C  3.65k  R-EU_R0805  [R0805]
R_SSR-2D  3.65k  R-EU_R0805  [R0805]
R_SSR-2E  3.65k  R-EU_R0805  [R0805]
R_SSR-2F  3.65k  R-EU_R0805  [R0805]
R_SSR-2G  3.65k  R-EU_R0805  [R0805]
R_SSR-2H  3.65k  R-EU_R0805  [R0805]
R_SSR-2J  3.65k  R-EU_R0805  [R0805]
R_SSR-3A  3.65k  R-EU_R0805  [R0805]
R_SSR-3B  3.65k  R-EU_R0805  [R0805]
R_SSR-3C  3.65k  R-EU_R0805  [R0805]
R_SSR-3D  3.65k  R-EU_R0805  [R0805]
R_SSR-3E  3.65k  R-EU_R0805  [R0805]
R_SSR-3F  3.65k  R-EU_R0805  [R0805]
R_SSR-3G  3.65k  R-EU_R0805  [R0805]
R_SSR-3H  3.65k  R-EU_R0805  [R0805]
R_SSR-3J  3.65k  R-EU_R0805  [R0805]
R_SSR-4A  3.65k  R-EU_R0805  [R0805]
R_SSR-4B  3.65k  R-EU_R0805  [R0805]
R_SSR-4C  3.65k  R-EU_R0805  [R0805]
R_SSR-4D  3.65k  R-EU_R0805  [R0805]
R_SSR-4E  3.65k  R-EU_R0805  [R0805]
R_SSR-4F  3.65k  R-EU_R0805  [R0805]
R_SSR-4G  3.65k  R-EU_R0805  [R0805]
R_SSR-4H  3.65k  R-EU_R0805  [R0805]
R_SSR-4J  3.65k  R-EU_R0805  [R0805]
R_SSR-5A  3.65k  R-EU_R0805  [R0805]
R_SSR-5B  3.65k  R-EU_R0805  [R0805]
R_SSR-5C  3.65k  R-EU_R0805  [R0805]
R_SSR-5D  3.65k  R-EU_R0805  [R0805]
R_SSR-5E  3.65k  R-EU_R0805  [R0805]
R_SSR-5F  3.65k  R-EU_R0805  [R0805]
R_SSR-5G  3.65k  R-EU_R0805  [R0805]
R_SSR-5H  3.65k  R-EU_R0805  [R0805]
R_SSR-5J  3.65k  R-EU_R0805  [R0805]
R_SSR-6A  3.65k  R-EU_R0805  [R0805]
R_SSR-6B  3.65k  R-EU_R0805  [R0805]
R_SSR-6C  3.65k  R-EU_R0805  [R0805]
R_SSR-6D  3.65k  R-EU_R0805  [R0805]
R_SSR-6E  3.65k  R-EU_R0805  [R0805]
R_SSR-6F  3.65k  R-EU_R0805  [R0805]
R_SSR-6G  3.65k  R-EU_R0805  [R0805]
R_SSR-6H  3.65k  R-EU_R0805  [R0805]
R_SSR-6J  3.65k  R-EU_R0805  [R0805]
R_SSR-7A  3.65k  R-EU_R0805  [R0805]
R_SSR-7B  3.65k  R-EU_R0805  [R0805]
R_SSR-7C  3.65k  R-EU_R0805  [R0805]
R_SSR-7D  3.65k  R-EU_R0805  [R0805]
R_SSR-7E  3.65k  R-EU_R0805  [R0805]
R_SSR-7F  3.65k  R-EU_R0805  [R0805]
R_SSR-7G  3.65k  R-EU_R0805  [R0805]
R_SSR-7H  3.65k  R-EU_R0805  [R0805]
R_SSR-7J  3.65k  R-EU_R0805  [R0805]
R_SSR-8A  3.65k  R-EU_R0805  [R0805]
R_SSR-8B  3.65k  R-EU_R0805  [R0805]
R_SSR-8C  3.65k  R-EU_R0805  [R0805]
R_SSR-8D  3.65k  R-EU_R0805  [R0805]
R_SSR-8E  3.65k  R-EU_R0805  [R0805]
R_SSR-8F  3.65k  R-EU_R0805  [R0805]
R_SSR-8G  3.65k  R-EU_R0805  [R0805]
R_SSR-8H  3.65k  R-EU_R0805  [R0805]
R_SSR-8J  3.65k  R-EU_R0805  [R0805]
SHIFTER1  SHIFT-REGISTER_74XX595QFN16  [QFN-16]
SHIFTER2  SHIFT-REGISTER_74XX595QFN16  [QFN-16]
SHIFTER3  SHIFT-REGISTER_74XX595QFN16  [QFN-16]
SHIFTER4  SHIFT-REGISTER_74XX595QFN16  [QFN-16]
SHIFTER5  SHIFT-REGISTER_74XX595QFN16  [QFN-16]
SHIFTER6  SHIFT-REGISTER_74XX595QFN16  [QFN-16]
SHIFTER7  SHIFT-REGISTER_74XX595QFN16  [QFN-16]
SHIFTER8  SHIFT-REGISTER_74XX595QFN16  [QFN-16]
SHIFTER9  SHIFT-REGISTER_74XX595QFN16  [QFN-16]
SSR_1AB  SSR_COTO_C334S  [SOP8]
SSR_1CD  SSR_COTO_C334S  [SOP8]
SSR_1EF  SSR_COTO_C334S  [SOP8]
SSR_1GH  SSR_COTO_C334S  [SOP8]
SSR_1J/2A  SSR_COTO_C334S  [SOP8]
SSR_2BC  SSR_COTO_C334S  [SOP8]
SSR_2DE  SSR_COTO_C334S  [SOP8]
SSR_2FG  SSR_COTO_C334S  [SOP8]
SSR_2HJ  SSR_COTO_C334S  [SOP8]
SSR_3AB  SSR_COTO_C334S  [SOP8]
SSR_3CD  SSR_COTO_C334S  [SOP8]
SSR_3EF  SSR_COTO_C334S  [SOP8]
SSR_3GH  SSR_COTO_C334S  [SOP8]
SSR_3J/4A  SSR_COTO_C334S  [SOP8]
SSR_4BC  SSR_COTO_C334S  [SOP8]
SSR_4DE  SSR_COTO_C334S  [SOP8]
SSR_4FG  SSR_COTO_C334S  [SOP8]
SSR_4HJ  SSR_COTO_C334S  [SOP8]
SSR_5AB  SSR_COTO_C334S  [SOP8]
SSR_5CD  SSR_COTO_C334S  [SOP8]
SSR_5EF  SSR_COTO_C334S  [SOP8]
SSR_5GH  SSR_COTO_C334S  [SOP8]
SSR_5J/6A  SSR_COTO_C334S  [SOP8]
SSR_6BC  SSR_COTO_C334S  [SOP8]
SSR_6DE  SSR_COTO_C334S  [SOP8]
SSR_6FG  SSR_COTO_C334S  [SOP8]
SSR_6HJ  SSR_COTO_C334S  [SOP8]
SSR_7AB  SSR_COTO_C334S  [SOP8]
SSR_7CD  SSR_COTO_C334S  [SOP8]
SSR_7EF  SSR_COTO_C334S  [SOP8]
SSR_7GH  SSR_COTO_C334S  [SOP8]
SSR_7J/8A  SSR_COTO_C334S  [SOP8]
SSR_8BC  SSR_COTO_C334S  [SOP8]
SSR_8DE  SSR_COTO_C334S  [SOP8]
SSR_8FG  SSR_COTO_C334S  [SOP8]
SSR_8HJ  SSR_COTO_C334S  [SOP8]

### Nets
0V: SHIFTER1.8(-PWR:GND) SHIFTER2.8(-PWR:GND) SHIFTER3.8(-PWR:GND) SHIFTER4.8(-PWR:GND) SHIFTER5.8(-PWR:GND) SHIFTER6.8(-PWR:GND) SHIFTER7.8(-PWR:GND) SHIFTER8.8(-PWR:GND) SHIFTER9.8(-PWR:GND) ; also sheet 1,2
+5V: R_SSR-1A.2 R_SSR-1B.2 R_SSR-1C.2 R_SSR-1D.2 R_SSR-1E.2 R_SSR-1F.2 R_SSR-1G.2 R_SSR-1H.2 R_SSR-1J.2 R_SSR-2A.2 R_SSR-2B.2 R_SSR-2C.2 R_SSR-2D.2 R_SSR-2E.2 R_SSR-2F.2 R_SSR-2G.2 R_SSR-2H.2 R_SSR-2J.2 R_SSR-3A.2 R_SSR-3B.2 R_SSR-3C.2 R_SSR-3D.2 R_SSR-3E.2 R_SSR-3F.2 R_SSR-3G.2 R_SSR-3H.2 R_SSR-3J.2 R_SSR-4A.2 R_SSR-4B.2 R_SSR-4C.2 R_SSR-4D.2 R_SSR-4E.2 R_SSR-4F.2 R_SSR-4G.2 R_SSR-4H.2 R_SSR-4J.2 R_SSR-5A.2 R_SSR-5B.2 R_SSR-5C.2 R_SSR-5D.2 R_SSR-5E.2 R_SSR-5F.2 R_SSR-5G.2 R_SSR-5H.2 R_SSR-5J.2 R_SSR-6A.2 R_SSR-6B.2 R_SSR-6C.2 R_SSR-6D.2 R_SSR-6E.2 R_SSR-6F.2 R_SSR-6G.2 R_SSR-6H.2 R_SSR-6J.2 R_SSR-7A.2 R_SSR-7B.2 R_SSR-7C.2 R_SSR-7D.2 R_SSR-7E.2 R_SSR-7F.2 R_SSR-7G.2 R_SSR-7H.2 R_SSR-7J.2 R_SSR-8A.2 R_SSR-8B.2 R_SSR-8C.2 R_SSR-8D.2 R_SSR-8E.2 R_SSR-8F.2 R_SSR-8G.2 R_SSR-8H.2 R_SSR-8J.2 SHIFTER1.16(-PWR:VCC) SHIFTER2.16(-PWR:VCC) SHIFTER3.16(-PWR:VCC) SHIFTER4.16(-PWR:VCC) SHIFTER5.16(-PWR:VCC) SHIFTER6.16(-PWR:VCC) SHIFTER7.16(-PWR:VCC) SHIFTER8.16(-PWR:VCC) SHIFTER9.16(-PWR:VCC) ; also sheet 1,2
CH1_O+: SSR_1AB.5(-2:O1) SSR_1AB.7(-1:O1) SSR_1CD.5(-2:O1) SSR_1CD.7(-1:O1) SSR_1EF.5(-2:O1) SSR_1EF.7(-1:O1) SSR_1GH.5(-2:O1) SSR_1GH.7(-1:O1) SSR_1J/2A.7(-1:O1) ; also sheet 2
CH1_O-: PIEZO_HEADER_A1.1 PIEZO_HEADER_A1.3 PIEZO_HEADER_A1.5 PIEZO_HEADER_A1.7 PIEZO_HEADER_A1.9 PIEZO_HEADER_A1.11 PIEZO_HEADER_A1.13 PIEZO_HEADER_A1.15 PIEZO_HEADER_A1.17 PIEZO_HEADER_B1.10 ; also sheet 2
CH1_PA+: PIEZO_HEADER_A1.2 PIEZO_HEADER_B1.1 SSR_1AB.8(-1:O2)
CH1_PB+: PIEZO_HEADER_A1.4 PIEZO_HEADER_B1.2 SSR_1AB.6(-2:O2)
CH1_PC+: PIEZO_HEADER_A1.6 PIEZO_HEADER_B1.3 SSR_1CD.8(-1:O2)
CH1_PD+: PIEZO_HEADER_A1.8 PIEZO_HEADER_B1.4 SSR_1CD.6(-2:O2)
CH1_PE+: PIEZO_HEADER_A1.10 PIEZO_HEADER_B1.5 SSR_1EF.8(-1:O2)
CH1_PF+: PIEZO_HEADER_A1.12 PIEZO_HEADER_B1.6 SSR_1EF.6(-2:O2)
CH1_PG+: PIEZO_HEADER_A1.14 PIEZO_HEADER_B1.7 SSR_1GH.8(-1:O2)
CH1_PH+: PIEZO_HEADER_A1.16 PIEZO_HEADER_B1.8 SSR_1GH.6(-2:O2)
CH1_PJ+: PIEZO_HEADER_A1.18 PIEZO_HEADER_B1.9 SSR_1J/2A.8(-1:O2)
CH2_O+: SSR_1J/2A.5(-2:O1) SSR_2BC.5(-2:O1) SSR_2BC.7(-1:O1) SSR_2DE.5(-2:O1) SSR_2DE.7(-1:O1) SSR_2FG.5(-2:O1) SSR_2FG.7(-1:O1) SSR_2HJ.5(-2:O1) SSR_2HJ.7(-1:O1) ; also sheet 2
CH2_O-: PIEZO_HEADER_A1.19 PIEZO_HEADER_A1.21 PIEZO_HEADER_A1.23 PIEZO_HEADER_A1.25 PIEZO_HEADER_A1.27 PIEZO_HEADER_A1.29 PIEZO_HEADER_A1.31 PIEZO_HEADER_A1.33 PIEZO_HEADER_A1.35 PIEZO_HEADER_B1.20 ; also sheet 2
CH2_PA+: PIEZO_HEADER_A1.20 PIEZO_HEADER_B1.11 SSR_1J/2A.6(-2:O2)
CH2_PB+: PIEZO_HEADER_A1.22 PIEZO_HEADER_B1.12 SSR_2BC.8(-1:O2)
CH2_PC+: PIEZO_HEADER_A1.24 PIEZO_HEADER_B1.13 SSR_2BC.6(-2:O2)
CH2_PD+: PIEZO_HEADER_A1.26 PIEZO_HEADER_B1.14 SSR_2DE.8(-1:O2)
CH2_PE+: PIEZO_HEADER_A1.28 PIEZO_HEADER_B1.15 SSR_2DE.6(-2:O2)
CH2_PF+: PIEZO_HEADER_A1.30 PIEZO_HEADER_B1.16 SSR_2FG.8(-1:O2)
CH2_PG+: PIEZO_HEADER_A1.32 PIEZO_HEADER_B1.17 SSR_2FG.6(-2:O2)
CH2_PH+: PIEZO_HEADER_A1.34 PIEZO_HEADER_B1.18 SSR_2HJ.8(-1:O2)
CH2_PJ+: PIEZO_HEADER_A1.36 PIEZO_HEADER_B1.19 SSR_2HJ.6(-2:O2)
CH3_O+: SSR_3AB.5(-2:O1) SSR_3AB.7(-1:O1) SSR_3CD.5(-2:O1) SSR_3CD.7(-1:O1) SSR_3EF.5(-2:O1) SSR_3EF.7(-1:O1) SSR_3GH.5(-2:O1) SSR_3GH.7(-1:O1) SSR_3J/4A.7(-1:O1) ; also sheet 2
CH3_O-: PIEZO_HEADER_A2.1 PIEZO_HEADER_A2.3 PIEZO_HEADER_A2.5 PIEZO_HEADER_A2.7 PIEZO_HEADER_A2.9 PIEZO_HEADER_A2.11 PIEZO_HEADER_A2.13 PIEZO_HEADER_A2.15 PIEZO_HEADER_A2.17 PIEZO_HEADER_B1.30 ; also sheet 2
CH3_PA+: PIEZO_HEADER_A2.2 PIEZO_HEADER_B1.21 SSR_3AB.8(-1:O2)
CH3_PB+: PIEZO_HEADER_A2.4 PIEZO_HEADER_B1.22 SSR_3AB.6(-2:O2)
CH3_PC+: PIEZO_HEADER_A2.6 PIEZO_HEADER_B1.23 SSR_3CD.8(-1:O2)
CH3_PD+: PIEZO_HEADER_A2.8 PIEZO_HEADER_B1.24 SSR_3CD.6(-2:O2)
CH3_PE+: PIEZO_HEADER_A2.10 PIEZO_HEADER_B1.25 SSR_3EF.8(-1:O2)
CH3_PF+: PIEZO_HEADER_A2.12 PIEZO_HEADER_B1.26 SSR_3EF.6(-2:O2)
CH3_PG+: PIEZO_HEADER_A2.14 PIEZO_HEADER_B1.27 SSR_3GH.8(-1:O2)
CH3_PH+: PIEZO_HEADER_A2.16 PIEZO_HEADER_B1.28 SSR_3GH.6(-2:O2)
CH3_PJ+: PIEZO_HEADER_A2.18 PIEZO_HEADER_B1.29 SSR_3J/4A.8(-1:O2)
CH4_O+: SSR_3J/4A.5(-2:O1) SSR_4BC.5(-2:O1) SSR_4BC.7(-1:O1) SSR_4DE.5(-2:O1) SSR_4DE.7(-1:O1) SSR_4FG.5(-2:O1) SSR_4FG.7(-1:O1) SSR_4HJ.5(-2:O1) SSR_4HJ.7(-1:O1) ; also sheet 2
CH4_O-: PIEZO_HEADER_A2.19 PIEZO_HEADER_A2.21 PIEZO_HEADER_A2.23 PIEZO_HEADER_A2.25 PIEZO_HEADER_A2.27 PIEZO_HEADER_A2.29 PIEZO_HEADER_A2.31 PIEZO_HEADER_A2.33 PIEZO_HEADER_A2.35 PIEZO_HEADER_B1.40 ; also sheet 2
CH4_PA+: PIEZO_HEADER_A2.20 PIEZO_HEADER_B1.31 SSR_3J/4A.6(-2:O2)
CH4_PB+: PIEZO_HEADER_A2.22 PIEZO_HEADER_B1.32 SSR_4BC.8(-1:O2)
CH4_PC+: PIEZO_HEADER_A2.24 PIEZO_HEADER_B1.33 SSR_4BC.6(-2:O2)
CH4_PD+: PIEZO_HEADER_A2.26 PIEZO_HEADER_B1.34 SSR_4DE.8(-1:O2)
CH4_PE+: PIEZO_HEADER_A2.28 PIEZO_HEADER_B1.35 SSR_4DE.6(-2:O2)
CH4_PF+: PIEZO_HEADER_A2.30 PIEZO_HEADER_B1.36 SSR_4FG.8(-1:O2)
CH4_PG+: PIEZO_HEADER_A2.32 PIEZO_HEADER_B1.37 SSR_4FG.6(-2:O2)
CH4_PH+: PIEZO_HEADER_A2.34 PIEZO_HEADER_B1.38 SSR_4HJ.8(-1:O2)
CH4_PJ+: PIEZO_HEADER_A2.36 PIEZO_HEADER_B1.39 SSR_4HJ.6(-2:O2)
CH5_O+: SSR_5AB.5(-2:O1) SSR_5AB.7(-1:O1) SSR_5CD.5(-2:O1) SSR_5CD.7(-1:O1) SSR_5EF.5(-2:O1) SSR_5EF.7(-1:O1) SSR_5GH.5(-2:O1) SSR_5GH.7(-1:O1) SSR_5J/6A.7(-1:O1) ; also sheet 2
CH5_O-: PIEZO_HEADER_A3.1 PIEZO_HEADER_A3.3 PIEZO_HEADER_A3.5 PIEZO_HEADER_A3.7 PIEZO_HEADER_A3.9 PIEZO_HEADER_A3.11 PIEZO_HEADER_A3.13 PIEZO_HEADER_A3.15 PIEZO_HEADER_A3.17 PIEZO_HEADER_B2.10 ; also sheet 2
CH5_PA+: PIEZO_HEADER_A3.2 PIEZO_HEADER_B2.1 SSR_5AB.8(-1:O2)
CH5_PB+: PIEZO_HEADER_A3.4 PIEZO_HEADER_B2.2 SSR_5AB.6(-2:O2)
CH5_PC+: PIEZO_HEADER_A3.6 PIEZO_HEADER_B2.3 SSR_5CD.8(-1:O2)
CH5_PD+: PIEZO_HEADER_A3.8 PIEZO_HEADER_B2.4 SSR_5CD.6(-2:O2)
CH5_PE+: PIEZO_HEADER_A3.10 PIEZO_HEADER_B2.5 SSR_5EF.8(-1:O2)
CH5_PF+: PIEZO_HEADER_A3.12 PIEZO_HEADER_B2.6 SSR_5EF.6(-2:O2)
CH5_PG+: PIEZO_HEADER_A3.14 PIEZO_HEADER_B2.7 SSR_5GH.8(-1:O2)
CH5_PH+: PIEZO_HEADER_A3.16 PIEZO_HEADER_B2.8 SSR_5GH.6(-2:O2)
CH5_PJ+: PIEZO_HEADER_A3.18 PIEZO_HEADER_B2.9 SSR_5J/6A.8(-1:O2)
CH6_O+: SSR_5J/6A.5(-2:O1) SSR_6BC.5(-2:O1) SSR_6BC.7(-1:O1) SSR_6DE.5(-2:O1) SSR_6DE.7(-1:O1) SSR_6FG.5(-2:O1) SSR_6FG.7(-1:O1) SSR_6HJ.5(-2:O1) SSR_6HJ.7(-1:O1) ; also sheet 2
CH6_O-: PIEZO_HEADER_A3.19 PIEZO_HEADER_A3.21 PIEZO_HEADER_A3.23 PIEZO_HEADER_A3.25 PIEZO_HEADER_A3.27 PIEZO_HEADER_A3.29 PIEZO_HEADER_A3.31 PIEZO_HEADER_A3.33 PIEZO_HEADER_A3.35 PIEZO_HEADER_B2.20 ; also sheet 2
CH6_PA+: PIEZO_HEADER_A3.20 PIEZO_HEADER_B2.11 SSR_5J/6A.6(-2:O2)
CH6_PB+: PIEZO_HEADER_A3.22 PIEZO_HEADER_B2.12 SSR_6BC.8(-1:O2)
CH6_PC+: PIEZO_HEADER_A3.24 PIEZO_HEADER_B2.13 SSR_6BC.6(-2:O2)
CH6_PD+: PIEZO_HEADER_A3.26 PIEZO_HEADER_B2.14 SSR_6DE.8(-1:O2)
CH6_PE+: PIEZO_HEADER_A3.28 PIEZO_HEADER_B2.15 SSR_6DE.6(-2:O2)
CH6_PF+: PIEZO_HEADER_A3.30 PIEZO_HEADER_B2.16 SSR_6FG.8(-1:O2)
CH6_PG+: PIEZO_HEADER_A3.32 PIEZO_HEADER_B2.17 SSR_6FG.6(-2:O2)
CH6_PH+: PIEZO_HEADER_A3.34 PIEZO_HEADER_B2.18 SSR_6HJ.8(-1:O2)
CH6_PJ+: PIEZO_HEADER_A3.36 PIEZO_HEADER_B2.19 SSR_6HJ.6(-2:O2)
CH7_O+: SSR_7AB.5(-2:O1) SSR_7AB.7(-1:O1) SSR_7CD.5(-2:O1) SSR_7CD.7(-1:O1) SSR_7EF.5(-2:O1) SSR_7EF.7(-1:O1) SSR_7GH.5(-2:O1) SSR_7GH.7(-1:O1) SSR_7J/8A.7(-1:O1) ; also sheet 2
CH7_O-: PIEZO_HEADER_A4.1 PIEZO_HEADER_A4.3 PIEZO_HEADER_A4.5 PIEZO_HEADER_A4.7 PIEZO_HEADER_A4.9 PIEZO_HEADER_A4.11 PIEZO_HEADER_A4.13 PIEZO_HEADER_A4.15 PIEZO_HEADER_A4.17 PIEZO_HEADER_B2.30 ; also sheet 2
CH7_PA+: PIEZO_HEADER_A4.2 PIEZO_HEADER_B2.21 SSR_7AB.8(-1:O2)
CH7_PB+: PIEZO_HEADER_A4.4 PIEZO_HEADER_B2.22 SSR_7AB.6(-2:O2)
CH7_PC+: PIEZO_HEADER_A4.6 PIEZO_HEADER_B2.23 SSR_7CD.8(-1:O2)
CH7_PD+: PIEZO_HEADER_A4.8 PIEZO_HEADER_B2.24 SSR_7CD.6(-2:O2)
CH7_PE+: PIEZO_HEADER_A4.10 PIEZO_HEADER_B2.25 SSR_7EF.8(-1:O2)
CH7_PF+: PIEZO_HEADER_A4.12 PIEZO_HEADER_B2.26 SSR_7EF.6(-2:O2)
CH7_PG+: PIEZO_HEADER_A4.14 PIEZO_HEADER_B2.27 SSR_7GH.8(-1:O2)
CH7_PH+: PIEZO_HEADER_A4.16 PIEZO_HEADER_B2.28 SSR_7GH.6(-2:O2)
CH7_PJ+: PIEZO_HEADER_A4.18 PIEZO_HEADER_B2.29 SSR_7J/8A.8(-1:O2)
CH8_O+: SSR_7J/8A.5(-2:O1) SSR_8BC.5(-2:O1) SSR_8BC.7(-1:O1) SSR_8DE.5(-2:O1) SSR_8DE.7(-1:O1) SSR_8FG.5(-2:O1) SSR_8FG.7(-1:O1) SSR_8HJ.5(-2:O1) SSR_8HJ.7(-1:O1) ; also sheet 2
CH8_O-: PIEZO_HEADER_A4.19 PIEZO_HEADER_A4.21 PIEZO_HEADER_A4.23 PIEZO_HEADER_A4.25 PIEZO_HEADER_A4.27 PIEZO_HEADER_A4.29 PIEZO_HEADER_A4.31 PIEZO_HEADER_A4.33 PIEZO_HEADER_A4.35 PIEZO_HEADER_B2.40 ; also sheet 2
CH8_PA+: PIEZO_HEADER_A4.20 PIEZO_HEADER_B2.31 SSR_7J/8A.6(-2:O2)
CH8_PB+: PIEZO_HEADER_A4.22 PIEZO_HEADER_B2.32 SSR_8BC.8(-1:O2)
CH8_PC+: PIEZO_HEADER_A4.24 PIEZO_HEADER_B2.33 SSR_8BC.6(-2:O2)
CH8_PD+: PIEZO_HEADER_A4.26 PIEZO_HEADER_B2.34 SSR_8DE.8(-1:O2)
CH8_PE+: PIEZO_HEADER_A4.28 PIEZO_HEADER_B2.35 SSR_8DE.6(-2:O2)
CH8_PF+: PIEZO_HEADER_A4.30 PIEZO_HEADER_B2.36 SSR_8FG.8(-1:O2)
CH8_PG+: PIEZO_HEADER_A4.32 PIEZO_HEADER_B2.37 SSR_8FG.6(-2:O2)
CH8_PH+: PIEZO_HEADER_A4.34 PIEZO_HEADER_B2.38 SSR_8HJ.8(-1:O2)
CH8_PJ+: PIEZO_HEADER_A4.36 PIEZO_HEADER_B2.39 SSR_8HJ.6(-2:O2)
N$10: SHIFTER2.9(-LOGIC:SO) SHIFTER3.14(-LOGIC:SI)
N$11: SHIFTER1.9(-LOGIC:SO) SHIFTER2.14(-LOGIC:SI)
N$12: SHIFTER3.9(-LOGIC:SO) SHIFTER4.14(-LOGIC:SI)
N$13: SHIFTER4.9(-LOGIC:SO) SHIFTER5.14(-LOGIC:SI)
N$57: SHIFTER5.9(-LOGIC:SO) SHIFTER6.14(-LOGIC:SI)
N$58: SHIFTER6.9(-LOGIC:SO) SHIFTER7.14(-LOGIC:SI)
N$59: SHIFTER7.9(-LOGIC:SO) SHIFTER8.14(-LOGIC:SI)
N$96: R_SSR-1A.1 SSR_1AB.1(-1:I+)
N$97: R_SSR-1B.1 SSR_1AB.3(-2:I+)
N$100: R_SSR-1C.1 SSR_1CD.1(-1:I+)
N$101: R_SSR-1D.1 SSR_1CD.3(-2:I+)
N$102: R_SSR-1E.1 SSR_1EF.1(-1:I+)
N$103: R_SSR-1F.1 SSR_1EF.3(-2:I+)
N$104: R_SSR-1G.1 SSR_1GH.1(-1:I+)
N$105: R_SSR-1H.1 SSR_1GH.3(-2:I+)
N$106: R_SSR-1J.1 SSR_1J/2A.1(-1:I+)
N$107: R_SSR-2A.1 SSR_1J/2A.3(-2:I+)
N$108: R_SSR-2B.1 SSR_2BC.1(-1:I+)
N$109: R_SSR-2C.1 SSR_2BC.3(-2:I+)
N$110: R_SSR-3A.1 SSR_3AB.1(-1:I+)
N$111: R_SSR-3B.1 SSR_3AB.3(-2:I+)
N$112: R_SSR-3C.1 SSR_3CD.1(-1:I+)
N$113: R_SSR-3D.1 SSR_3CD.3(-2:I+)
N$114: R_SSR-3E.1 SSR_3EF.1(-1:I+)
N$115: R_SSR-3F.1 SSR_3EF.3(-2:I+)
N$116: R_SSR-3J.1 SSR_3J/4A.1(-1:I+)
N$117: R_SSR-3H.1 SSR_3GH.3(-2:I+)
N$118: R_SSR-3G.1 SSR_3GH.1(-1:I+)
N$119: R_SSR-2D.1 SSR_2DE.1(-1:I+)
N$120: R_SSR-2E.1 SSR_2DE.3(-2:I+)
N$121: R_SSR-2F.1 SSR_2FG.1(-1:I+)
N$122: R_SSR-2J.1 SSR_2HJ.3(-2:I+)
N$123: R_SSR-2H.1 SSR_2HJ.1(-1:I+)
N$124: R_SSR-2G.1 SSR_2FG.3(-2:I+)
N$134: R_SSR-4A.1 SSR_3J/4A.3(-2:I+)
N$135: R_SSR-4B.1 SSR_4BC.1(-1:I+)
N$136: R_SSR-4C.1 SSR_4BC.3(-2:I+)
N$137: R_SSR-4D.1 SSR_4DE.1(-1:I+)
N$138: R_SSR-4E.1 SSR_4DE.3(-2:I+)
N$139: R_SSR-4F.1 SSR_4FG.1(-1:I+)
N$140: R_SSR-4J.1 SSR_4HJ.3(-2:I+)
N$141: R_SSR-4H.1 SSR_4HJ.1(-1:I+)
N$142: R_SSR-4G.1 SSR_4FG.3(-2:I+)
N$152: R_SSR-5A.1 SSR_5AB.1(-1:I+)
N$153: R_SSR-5B.1 SSR_5AB.3(-2:I+)
N$154: R_SSR-5C.1 SSR_5CD.1(-1:I+)
N$155: R_SSR-5D.1 SSR_5CD.3(-2:I+)
N$156: R_SSR-5E.1 SSR_5EF.1(-1:I+)
N$157: R_SSR-5F.1 SSR_5EF.3(-2:I+)
N$158: R_SSR-5J.1 SSR_5J/6A.1(-1:I+)
N$159: R_SSR-5H.1 SSR_5GH.3(-2:I+)
N$160: R_SSR-5G.1 SSR_5GH.1(-1:I+)
N$251: R_SSR-6A.1 SSR_5J/6A.3(-2:I+)
N$252: R_SSR-6B.1 SSR_6BC.1(-1:I+)
N$253: R_SSR-6C.1 SSR_6BC.3(-2:I+)
N$254: R_SSR-6D.1 SSR_6DE.1(-1:I+)
N$255: R_SSR-6E.1 SSR_6DE.3(-2:I+)
N$256: R_SSR-6F.1 SSR_6FG.1(-1:I+)
N$257: R_SSR-6J.1 SSR_6HJ.3(-2:I+)
N$258: R_SSR-6H.1 SSR_6HJ.1(-1:I+)
N$259: R_SSR-6G.1 SSR_6FG.3(-2:I+)
N$269: R_SSR-7A.1 SSR_7AB.1(-1:I+)
N$270: R_SSR-7B.1 SSR_7AB.3(-2:I+)
N$271: R_SSR-7C.1 SSR_7CD.1(-1:I+)
N$272: R_SSR-7D.1 SSR_7CD.3(-2:I+)
N$273: R_SSR-7E.1 SSR_7EF.1(-1:I+)
N$274: R_SSR-7F.1 SSR_7EF.3(-2:I+)
N$275: R_SSR-7J.1 SSR_7J/8A.1(-1:I+)
N$276: R_SSR-7H.1 SSR_7GH.3(-2:I+)
N$277: R_SSR-7G.1 SSR_7GH.1(-1:I+)
N$287: R_SSR-8A.1 SSR_7J/8A.3(-2:I+)
N$288: R_SSR-8B.1 SSR_8BC.1(-1:I+)
N$289: R_SSR-8C.1 SSR_8BC.3(-2:I+)
N$290: R_SSR-8D.1 SSR_8DE.1(-1:I+)
N$291: R_SSR-8E.1 SSR_8DE.3(-2:I+)
N$292: R_SSR-8F.1 SSR_8FG.1(-1:I+)
N$293: R_SSR-8J.1 SSR_8HJ.3(-2:I+)
N$294: R_SSR-8H.1 SSR_8HJ.1(-1:I+)
N$295: R_SSR-8G.1 SSR_8FG.3(-2:I+)
REG_CLR: SHIFTER1.10(-LOGIC:!SCLR) SHIFTER2.10(-LOGIC:!SCLR) SHIFTER3.10(-LOGIC:!SCLR) SHIFTER4.10(-LOGIC:!SCLR) SHIFTER5.10(-LOGIC:!SCLR) SHIFTER6.10(-LOGIC:!SCLR) SHIFTER7.10(-LOGIC:!SCLR) SHIFTER8.10(-LOGIC:!SCLR) SHIFTER9.10(-LOGIC:!SCLR) ; also sheet 1
REG_LOAD: SHIFTER1.12(-LOGIC:RCK) SHIFTER2.12(-LOGIC:RCK) SHIFTER3.12(-LOGIC:RCK) SHIFTER4.12(-LOGIC:RCK) SHIFTER5.12(-LOGIC:RCK) SHIFTER6.12(-LOGIC:RCK) SHIFTER7.12(-LOGIC:RCK) SHIFTER8.12(-LOGIC:RCK) SHIFTER9.12(-LOGIC:RCK) ; also sheet 1
REG_OE: SHIFTER1.13(-LOGIC:!G) SHIFTER2.13(-LOGIC:!G) SHIFTER3.13(-LOGIC:!G) SHIFTER4.13(-LOGIC:!G) SHIFTER5.13(-LOGIC:!G) SHIFTER6.13(-LOGIC:!G) SHIFTER7.13(-LOGIC:!G) SHIFTER8.13(-LOGIC:!G) SHIFTER9.13(-LOGIC:!G) ; also sheet 1
SPI_MOSI: SHIFTER1.14(-LOGIC:SI) ; also sheet 1
SPI_SCLK: SHIFTER1.11(-LOGIC:SCK) SHIFTER2.11(-LOGIC:SCK) SHIFTER3.11(-LOGIC:SCK) SHIFTER4.11(-LOGIC:SCK) SHIFTER5.11(-LOGIC:SCK) SHIFTER6.11(-LOGIC:SCK) SHIFTER7.11(-LOGIC:SCK) SHIFTER8.11(-LOGIC:SCK) SHIFTER9.11(-LOGIC:SCK) ; also sheet 1
SW-1A: SHIFTER1.15(-LOGIC:Q0) SSR_1AB.2(-1:I-)
SW-1B: SHIFTER1.1(-LOGIC:Q1) SSR_1AB.4(-2:I-)
SW-1C: SHIFTER1.2(-LOGIC:Q2) SSR_1CD.2(-1:I-)
SW-1D: SHIFTER1.3(-LOGIC:Q3) SSR_1CD.4(-2:I-)
SW-1E: SHIFTER1.4(-LOGIC:Q4) SSR_1EF.2(-1:I-)
SW-1F: SHIFTER1.5(-LOGIC:Q5) SSR_1EF.4(-2:I-)
SW-1G: SHIFTER1.6(-LOGIC:Q6) SSR_1GH.2(-1:I-)
SW-1H: SHIFTER1.7(-LOGIC:Q7) SSR_1GH.4(-2:I-)
SW-1J: SHIFTER2.15(-LOGIC:Q0) SSR_1J/2A.2(-1:I-)
SW-2A: SHIFTER2.1(-LOGIC:Q1) SSR_1J/2A.4(-2:I-)
SW-2B: SHIFTER2.2(-LOGIC:Q2) SSR_2BC.2(-1:I-)
SW-2C: SHIFTER2.3(-LOGIC:Q3) SSR_2BC.4(-2:I-)
SW-2D: SHIFTER2.4(-LOGIC:Q4) SSR_2DE.2(-1:I-)
SW-2E: SHIFTER2.5(-LOGIC:Q5) SSR_2DE.4(-2:I-)
SW-2F: SHIFTER2.6(-LOGIC:Q6) SSR_2FG.2(-1:I-)
SW-2G: SHIFTER2.7(-LOGIC:Q7) SSR_2FG.4(-2:I-)
SW-2H: SHIFTER3.15(-LOGIC:Q0) SSR_2HJ.2(-1:I-)
SW-2J: SHIFTER3.1(-LOGIC:Q1) SSR_2HJ.4(-2:I-)
SW-3A: SHIFTER3.2(-LOGIC:Q2) SSR_3AB.2(-1:I-)
SW-3B: SHIFTER3.3(-LOGIC:Q3) SSR_3AB.4(-2:I-)
SW-3C: SHIFTER3.4(-LOGIC:Q4) SSR_3CD.2(-1:I-)
SW-3D: SHIFTER3.5(-LOGIC:Q5) SSR_3CD.4(-2:I-)
SW-3E: SHIFTER3.6(-LOGIC:Q6) SSR_3EF.2(-1:I-)
SW-3F: SHIFTER3.7(-LOGIC:Q7) SSR_3EF.4(-2:I-)
SW-3G: SHIFTER4.15(-LOGIC:Q0) SSR_3GH.2(-1:I-)
SW-3H: SHIFTER4.1(-LOGIC:Q1) SSR_3GH.4(-2:I-)
SW-3J: SHIFTER4.2(-LOGIC:Q2) SSR_3J/4A.2(-1:I-)
SW-4A: SHIFTER4.3(-LOGIC:Q3) SSR_3J/4A.4(-2:I-)
SW-4B: SHIFTER4.4(-LOGIC:Q4) SSR_4BC.2(-1:I-)
SW-4C: SHIFTER4.5(-LOGIC:Q5) SSR_4BC.4(-2:I-)
SW-4D: SHIFTER4.6(-LOGIC:Q6) SSR_4DE.2(-1:I-)
SW-4E: SHIFTER4.7(-LOGIC:Q7) SSR_4DE.4(-2:I-)
SW-4F: SHIFTER5.15(-LOGIC:Q0) SSR_4FG.2(-1:I-)
SW-4G: SHIFTER5.1(-LOGIC:Q1) SSR_4FG.4(-2:I-)
SW-4H: SHIFTER5.2(-LOGIC:Q2) SSR_4HJ.2(-1:I-)
SW-4J: SHIFTER5.3(-LOGIC:Q3) SSR_4HJ.4(-2:I-)
SW-5A: SHIFTER5.4(-LOGIC:Q4) SSR_5AB.2(-1:I-)
SW-5B: SHIFTER5.5(-LOGIC:Q5) SSR_5AB.4(-2:I-)
SW-5C: SHIFTER5.6(-LOGIC:Q6) SSR_5CD.2(-1:I-)
SW-5D: SHIFTER5.7(-LOGIC:Q7) SSR_5CD.4(-2:I-)
SW-5E: SHIFTER6.15(-LOGIC:Q0) SSR_5EF.2(-1:I-)
SW-5F: SHIFTER6.1(-LOGIC:Q1) SSR_5EF.4(-2:I-)
SW-5G: SHIFTER6.2(-LOGIC:Q2) SSR_5GH.2(-1:I-)
SW-5H: SHIFTER6.3(-LOGIC:Q3) SSR_5GH.4(-2:I-)
SW-5J: SHIFTER6.4(-LOGIC:Q4) SSR_5J/6A.2(-1:I-)
SW-6A: SHIFTER6.5(-LOGIC:Q5) SSR_5J/6A.4(-2:I-)
SW-6B: SHIFTER6.6(-LOGIC:Q6) SSR_6BC.2(-1:I-)
SW-6C: SHIFTER6.7(-LOGIC:Q7) SSR_6BC.4(-2:I-)
SW-6D: SHIFTER7.15(-LOGIC:Q0) SSR_6DE.2(-1:I-)
SW-6E: SHIFTER7.1(-LOGIC:Q1) SSR_6DE.4(-2:I-)
SW-6F: SHIFTER7.2(-LOGIC:Q2) SSR_6FG.2(-1:I-)
SW-6G: SHIFTER7.3(-LOGIC:Q3) SSR_6FG.4(-2:I-)
SW-6H: SHIFTER7.4(-LOGIC:Q4) SSR_6HJ.2(-1:I-)
SW-6J: SHIFTER7.5(-LOGIC:Q5) SSR_6HJ.4(-2:I-)
SW-7A: SHIFTER7.6(-LOGIC:Q6) SSR_7AB.2(-1:I-)
SW-7B: SHIFTER7.7(-LOGIC:Q7) SSR_7AB.4(-2:I-)
SW-7C: SHIFTER8.15(-LOGIC:Q0) SSR_7CD.2(-1:I-)
SW-7D: SHIFTER8.1(-LOGIC:Q1) SSR_7CD.4(-2:I-)
SW-7E: SHIFTER8.2(-LOGIC:Q2) SSR_7EF.2(-1:I-)
SW-7F: SHIFTER8.3(-LOGIC:Q3) SSR_7EF.4(-2:I-)
SW-7G: SHIFTER8.4(-LOGIC:Q4) SSR_7GH.2(-1:I-)
SW-7H: SHIFTER8.5(-LOGIC:Q5) SSR_7GH.4(-2:I-)
SW-7J: SHIFTER8.6(-LOGIC:Q6) SSR_7J/8A.2(-1:I-)
SW-8A: SHIFTER8.7(-LOGIC:Q7) SSR_7J/8A.4(-2:I-)
SW-8B: SHIFTER9.15(-LOGIC:Q0) SSR_8BC.2(-1:I-)
SW-8C: SHIFTER9.1(-LOGIC:Q1) SSR_8BC.4(-2:I-)
SW-8D: SHIFTER9.2(-LOGIC:Q2) SSR_8DE.2(-1:I-)
SW-8E: SHIFTER9.3(-LOGIC:Q3) SSR_8DE.4(-2:I-)
SW-8F: SHIFTER9.4(-LOGIC:Q4) SSR_8FG.2(-1:I-)
SW-8G: SHIFTER9.5(-LOGIC:Q5) SSR_8FG.4(-2:I-)
SW-8H: SHIFTER9.6(-LOGIC:Q6) SSR_8HJ.2(-1:I-)
SW-8J: SHIFTER9.7(-LOGIC:Q7) SSR_8HJ.4(-2:I-)
UART_TXD: SHIFTER8.9(-LOGIC:SO) SHIFTER9.14(-LOGIC:SI) ; also sheet 1
Unconnected: SHIFTER9.9(-LOGIC:SO)

### Notes on the sheet
- Shift registers
- Supply
- Relays 1-8(A-J) | Connectors
- OUTPUT STAGE

## Library data of the parts
AUDIO_IN = ICST:F25HP: SUB-D; OC_FARNELL: unknown; OC_NEWARK: unknown
C_AREF C_UC1-C_UC4 C_XTAL1 C_XTAL2 CPUMP1-CPUMP8 CVBST1-CVBST8 CVDD1-CVDD8 CVREG1-CVREG8 = SABRe:C-EU: CAPACITOR, European symbol
C_UC5 = SABRe:CPOL-EU: POLARIZED CAPACITOR, European symbol
DC_CONNECTOR = SABRe:LUMBERG-1613-14
DRV1-DRV8 = ICST:DRV2667
GND_LIFT = ICST:SWITCH_DPDT
JP1 JP2 = SABRe:HEADER_1X8
JTAG_HEADER = SABRe:PINHD-2X5: PIN HEADER
L1-L8 = SABRe:L-EU: INDUCTOR, European symbol
LED1-LED3 LED_SUP = SABRe:LED: LEDs Standard schematic elements and footprints for packages: 5mm 3mm 1206 0603
PIEZO_HEADER_A1-PIEZO_HEADER_A4 = SABRe:HEADER_2X18
PIEZO_HEADER_B1 PIEZO_HEADER_B2 = ICST:FH28-40S-0.5SH
R_GND1 R_GND2 RLED1-RLED3 RLED_SUP = rcl:R-EU_: RESISTOR, European symbol
R_JTAG R_REG_CLR R_REG_LOAD R_REG_OE R_RST R_SCL R_SDA R_SSR-1A R_SSR-1B R_SSR-1C R_SSR-1D R_SSR-1E R_SSR-1F R_SSR-1G R_SSR-1H R_SSR-1J R_SSR-2A R_SSR-2B R_SSR-2C R_SSR-2D R_SSR-2E R_SSR-2F R_SSR-2G R_SSR-2H R_SSR-2J R_SSR-3A R_SSR-3B R_SSR-3C R_SSR-3D R_SSR-3E R_SSR-3F R_SSR-3G R_SSR-3H R_SSR-3J R_SSR-4A R_SSR-4B R_SSR-4C R_SSR-4D R_SSR-4E R_SSR-4F R_SSR-4G R_SSR-4H R_SSR-4J R_SSR-5A R_SSR-5B R_SSR-5C R_SSR-5D R_SSR-5E R_SSR-5F R_SSR-5G R_SSR-5H R_SSR-5J R_SSR-6A R_SSR-6B R_SSR-6C R_SSR-6D R_SSR-6E R_SSR-6F R_SSR-6G R_SSR-6H R_SSR-6J R_SSR-7A R_SSR-7B R_SSR-7C R_SSR-7D R_SSR-7E R_SSR-7F R_SSR-7G R_SSR-7H R_SSR-7J R_SSR-8A R_SSR-8B R_SSR-8C R_SSR-8D R_SSR-8E R_SSR-8F R_SSR-8G R_SSR-8H R_SSR-8J REXT1-REXT8 RVBST1-1 RVBST1-2 RVBST2-1 RVBST2-2 RVBST3-1 RVBST3-2 RVBST4-1 RVBST4-2 RVBST5-1 RVBST5-2 RVBST6-1 RVBST6-2 RVBST7-1 RVBST7-2 RVBST8-1 RVBST8-2 = SABRe:R-EU_: RESISTOR, European symbol
SHIFTER1-SHIFTER9 = ICST:SHIFT-REGISTER_74XX595
SSR_1AB SSR_1CD SSR_1EF SSR_1GH SSR_1J/2A SSR_2BC SSR_2DE SSR_2FG SSR_2HJ SSR_3AB SSR_3CD SSR_3EF SSR_3GH SSR_3J/4A SSR_4BC SSR_4DE SSR_4FG SSR_4HJ SSR_5AB SSR_5CD SSR_5EF SSR_5GH SSR_5J/6A SSR_6BC SSR_6DE SSR_6FG SSR_6HJ SSR_7AB SSR_7CD SSR_7EF SSR_7GH SSR_7J/8A SSR_8BC SSR_8DE SSR_8FG SSR_8HJ = ICST:SSR_COTO_C334S
SW_RST = SABRe:B3FS: Omron B3FS SMD Tactile Switch Package: 6 x 6 mm
UC_SLAVE = atmel:MEGA32: MICROCONTROLLER 32 Kbytes FLASH 2 Kbytes SRAM 1 Kbytes EEPROM USART 8-channel 10 bit ADC Source: www.atmel.com .. doc2503.pdf; MPN: ATMEGA32-16AU; OC_FARNELL: 9171274; OC_NEWARK: 69K6677
XTAL = SABRe:CRYSTAL: CRYSTAL